# Altium project RFSoC-AMC.PrjPCB (part 3 of 22)

## Sheet RFMC_DAC.SchDoc: RFSoC AMC
size 420 x 297 mm; CompanyName: WUT; DrawnBy: T. Przywozki; Organization: WUT ISE; Address1: Warsaw University of Technology; Address2: Nowowiejska 15/19 00-665 Warsaw; Address3: Tomasz.Przywozki@pw.edu.pl; DocumentNumber: 43; Revision: 1; SheetNumber: 43; SheetTotal: 45; Project: RFSoC AMC; ModifiedBy: T. Przywozki; CreateDate: -; CheckedDate: -; DivGrp: ISE; Designer: T. Przywozki; ModifiedDate: -; ProjectName: ADC/DAC MEZZANINE
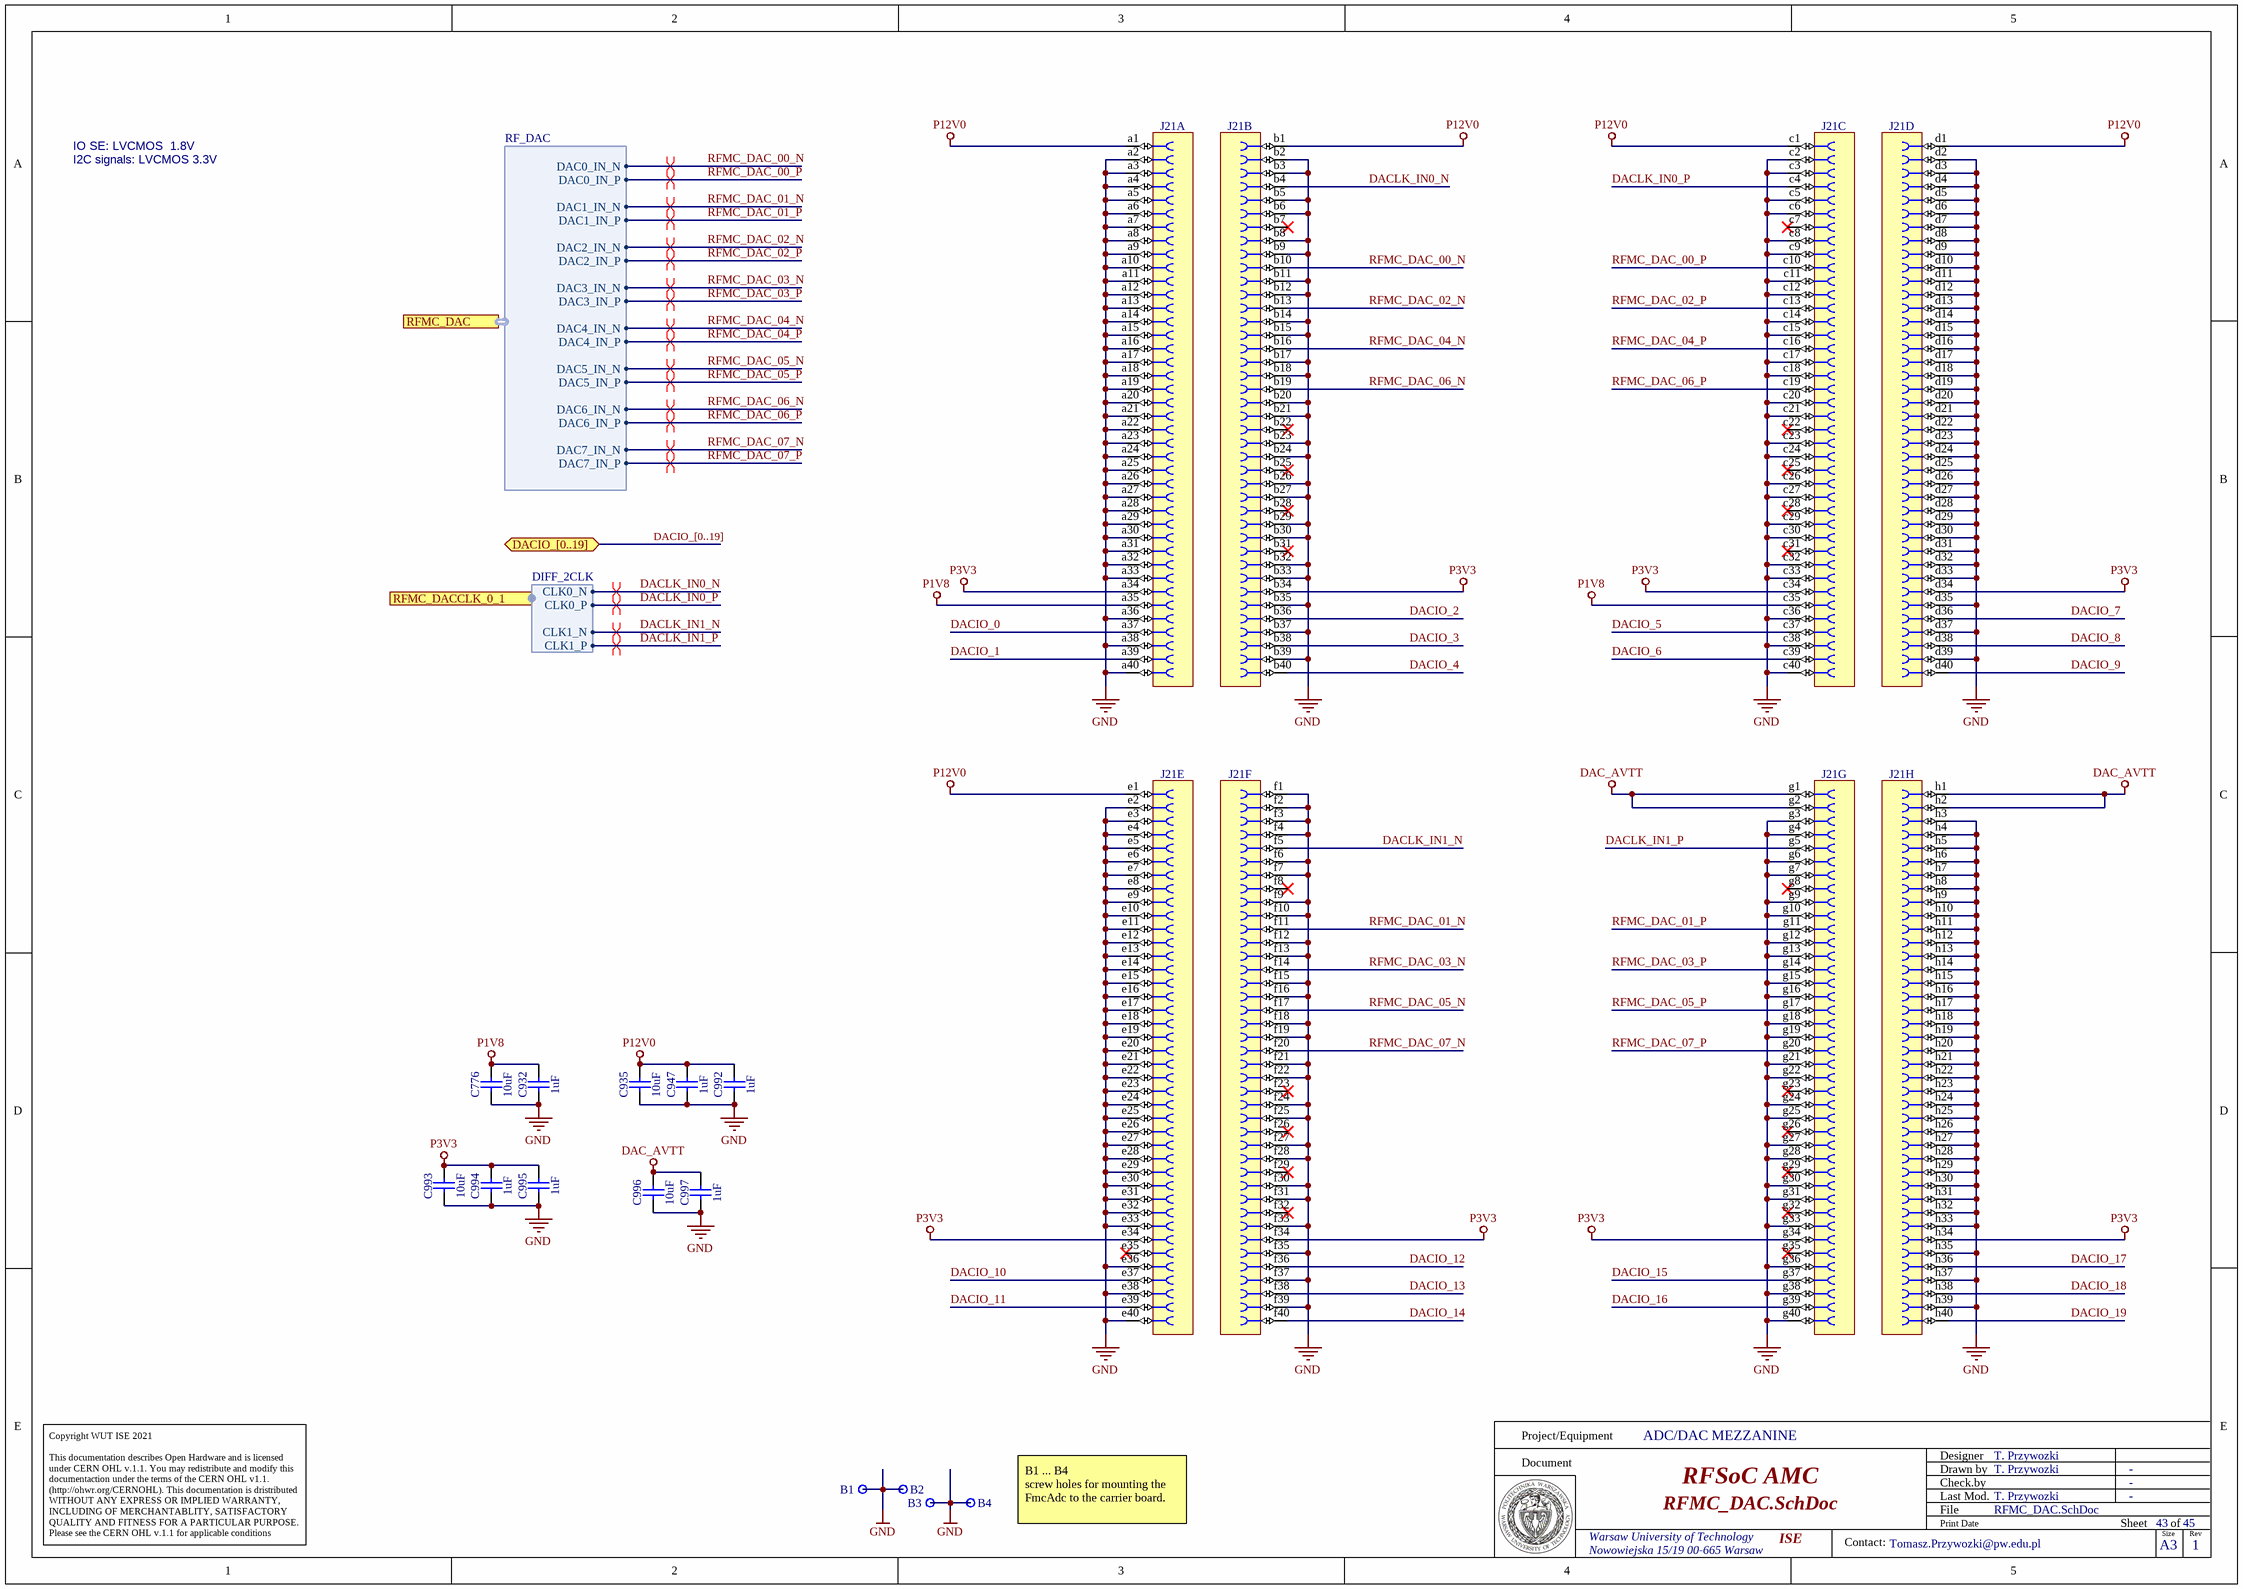
[diagram p4: RFMC_DAC.SchDoc]

### Parts
B1  Plated Hole  [MTG270_500]  (value not drawn)
B2  Plated Hole  [MTG270_500]  (value not drawn)
B3  Plated Hole  [MTG270_500]  (value not drawn)
B4  Plated Hole  [MTG270_500]  (value not drawn)
C776  10uF  [CAPC1608X80N]
C932  1uF  [CAPC1005X55N]
C935  10uF  [CAPC1608X80N]
C947  1uF  [CAPC1005X55N]
C992  1uF  [CAPC1005X55N]
C993  10uF  [CAPC1608X80N]
C994  1uF  [CAPC1005X55N]
C995  1uF  [CAPC1005X55N]
C996  10uF  [CAPC1608X80N]
C997  1uF  [CAPC1005X55N]
J21  (no value)  [SAMTEC_LPAF-40-03.0-S-08]  (parts A,B,C,D,E,F,G,H of 8)

### Ports
DACIO_[0..19] (bidir), RFMC_DAC (harness RF_DAC), RFMC_DACCLK_0_1 (harness DIFF_2CLK)

### Harnesses
RF_DAC: DAC0_IN_N, DAC0_IN_P, DAC1_IN_N, DAC1_IN_P, DAC2_IN_N, DAC2_IN_P, DAC3_IN_N, DAC3_IN_P, DAC4_IN_N, DAC4_IN_P, DAC5_IN_N, DAC5_IN_P, DAC6_IN_N, DAC6_IN_P, DAC7_IN_N, DAC7_IN_P
DIFF_2CLK: CLK0_P, CLK0_N, CLK1_P, CLK1_N

### Nets
DAC_AVTT: C996.2 C997.1 J21.g1 J21.g2 J21.h1 J21.h2
GND: B1.1 B2.1 B3.1 B4.1 C776.1 C932.2 C935.1 C947.2 C992.2 C993.1 C994.2 C995.2 C996.1 C997.2 J21.a2 J21.a3 J21.a4 J21.a5 J21.a6 J21.a7 J21.a8 J21.a9 J21.a10 J21.a11 J21.a12 J21.a13 J21.a14 J21.a15 J21.a16 J21.a17 J21.a18 J21.a19 J21.a20 J21.a21 J21.a22 J21.a23 J21.a24 J21.a25 J21.a26 J21.a27 J21.a28 J21.a29 J21.a30 J21.a31 J21.a32 J21.a33 J21.a36 J21.a38 J21.a40 J21.b2 J21.b3 J21.b5 J21.b6 J21.b8 J21.b9 J21.b11 J21.b12 J21.b14 J21.b15 J21.b17 J21.b18 J21.b20 J21.b21 J21.b23 J21.b24 J21.b26 J21.b27 J21.b29 J21.b30 J21.b32 J21.b33 J21.b35 J21.b37 J21.b39 J21.c2 J21.c3 J21.c5 J21.c6 J21.c8 J21.c9 J21.c11 J21.c12 J21.c14 J21.c15 J21.c17 J21.c18 J21.c20 J21.c21 J21.c23 J21.c24 J21.c26 J21.c27 J21.c29 J21.c30 J21.c32 J21.c33 J21.c36 J21.c38 J21.c40 J21.d2 J21.d3 J21.d4 J21.d5 J21.d6 J21.d7 J21.d8 J21.d9 J21.d10 J21.d11 J21.d12 J21.d13 J21.d14 J21.d15 J21.d16 J21.d17 J21.d18 J21.d19 J21.d20 J21.d21 J21.d22 J21.d23 J21.d24 J21.d25 J21.d26 J21.d27 J21.d28 J21.d29 J21.d30 J21.d31 J21.d32 J21.d33 J21.d35 J21.d37 J21.d39 J21.e2 J21.e3 J21.e4 J21.e5 J21.e6 J21.e7 J21.e8 J21.e9 J21.e10 J21.e11 J21.e12 J21.e13 J21.e14 J21.e15 J21.e16 J21.e17 J21.e18 J21.e19 J21.e20 J21.e21 J21.e22 J21.e23 J21.e24 J21.e25 J21.e26 J21.e27 J21.e28 J21.e29 J21.e30 J21.e31 J21.e32 J21.e33 J21.e36 J21.e38 J21.e40 J21.f1 J21.f2 J21.f3 J21.f4 J21.f6 J21.f7 J21.f9 J21.f10 J21.f12 J21.f13 J21.f15 J21.f16 J21.f18 J21.f19 J21.f21 J21.f22 J21.f24 J21.f25 J21.f27 J21.f28 J21.f30 J21.f31 J21.f33 J21.f35 J21.f37 J21.f39 J21.g3 J21.g4 J21.g6 J21.g7 J21.g9 J21.g10 J21.g12 J21.g13 J21.g15 J21.g16 J21.g18 J21.g19 J21.g21 J21.g22 J21.g24 J21.g25 J21.g27 J21.g28 J21.g30 J21.g31 J21.g33 J21.g36 J21.g38 J21.g40 J21.h3 J21.h4 J21.h5 J21.h6 J21.h7 J21.h8 J21.h9 J21.h10 J21.h11 J21.h12 J21.h13 J21.h14 J21.h15 J21.h16 J21.h17 J21.h18 J21.h19 J21.h20 J21.h21 J21.h22 J21.h23 J21.h24 J21.h25 J21.h26 J21.h27 J21.h28 J21.h29 J21.h30 J21.h31 J21.h32 J21.h33 J21.h35 J21.h37 J21.h39
P1V8: C776.2 C932.1 J21.a35 J21.c35
P3V3: C993.2 C994.1 C995.1 J21.a34 J21.b34 J21.c34 J21.d34 J21.e34 J21.f34 J21.g34 J21.h34
P12V0: C935.2 C947.1 C992.1 J21.a1 J21.b1 J21.c1 J21.d1 J21.e1
DACIO_0: J21.a37
DACIO_1: J21.a39
DACIO_2: J21.b36
DACIO_3: J21.b38
DACIO_4: J21.b40
DACIO_5: J21.c37
DACIO_6: J21.c39
DACIO_7: J21.d36
DACIO_8: J21.d38
DACIO_9: J21.d40
DACIO_10: J21.e37
DACIO_11: J21.e39
DACIO_12: J21.f36
DACIO_13: J21.f38
DACIO_14: J21.f40
DACIO_15: J21.g37
DACIO_16: J21.g39
DACIO_17: J21.h36
DACIO_18: J21.h38
DACIO_19: J21.h40
DACLK_IN0_N: J21.b4 ; port RFMC_DACCLK_0_1.CLK0_N
DACLK_IN0_P: J21.c4 ; port RFMC_DACCLK_0_1.CLK0_P
DACLK_IN1_N: J21.f5 ; port RFMC_DACCLK_0_1.CLK1_N
DACLK_IN1_P: J21.g5 ; port RFMC_DACCLK_0_1.CLK1_P
RFMC_DAC_00_N: J21.b10 ; port RFMC_DAC.DAC0_IN_N  [project net DAC0_OUT_N]
RFMC_DAC_00_P: J21.c10 ; port RFMC_DAC.DAC0_IN_P  [project net DAC0_OUT_P]
RFMC_DAC_01_N: J21.f11 ; port RFMC_DAC.DAC1_IN_N  [project net DAC1_OUT_N]
RFMC_DAC_01_P: J21.g11 ; port RFMC_DAC.DAC1_IN_P  [project net DAC1_OUT_P]
RFMC_DAC_02_N: J21.b13 ; port RFMC_DAC.DAC2_IN_N  [project net DAC2_OUT_N]
RFMC_DAC_02_P: J21.c13 ; port RFMC_DAC.DAC2_IN_P  [project net DAC2_OUT_P]
RFMC_DAC_03_N: J21.f14 ; port RFMC_DAC.DAC3_IN_N  [project net DAC3_OUT_N]
RFMC_DAC_03_P: J21.g14 ; port RFMC_DAC.DAC3_IN_P  [project net DAC3_OUT_P]
RFMC_DAC_04_N: J21.b16 ; port RFMC_DAC.DAC4_IN_N  [project net DAC4_OUT_N]
RFMC_DAC_04_P: J21.c16 ; port RFMC_DAC.DAC4_IN_P  [project net DAC4_OUT_P]
RFMC_DAC_05_N: J21.f17 ; port RFMC_DAC.DAC5_IN_N  [project net DAC5_OUT_N]
RFMC_DAC_05_P: J21.g17 ; port RFMC_DAC.DAC5_IN_P  [project net DAC5_OUT_P]
RFMC_DAC_06_N: J21.b19 ; port RFMC_DAC.DAC6_IN_N  [project net DAC6_OUT_N]
RFMC_DAC_06_P: J21.c19 ; port RFMC_DAC.DAC6_IN_P  [project net DAC6_OUT_P]
RFMC_DAC_07_N: J21.f20 ; port RFMC_DAC.DAC7_IN_N  [project net DAC7_OUT_N]
RFMC_DAC_07_P: J21.g20 ; port RFMC_DAC.DAC7_IN_P  [project net DAC7_OUT_P]

Not connected (* = marked no-connect by the designer): J21 b7* b22* b25* b28* b31* c7* c22* c25* c28* c31* e35* f8* f23* f26* f29* f32* g8* g23* g26* g29* g32* g35*

### Buses and harness runs
bus DACIO_[0..19] = port DACIO_[0..19]

### Layout directives
differential pair: DAC0_OUT_N, DAC0_OUT_P, DAC1_OUT_N, DAC1_OUT_P, DAC2_OUT_N, DAC2_OUT_P, DAC3_OUT_N, DAC3_OUT_P, DAC4_OUT_N, DAC4_OUT_P, DAC5_OUT_N, DAC5_OUT_P, DAC6_OUT_N, DAC6_OUT_P, DAC7_OUT_N, DAC7_OUT_P, DACLK_IN0_N, DACLK_IN0_P, DACLK_IN1_N, DACLK_IN1_P

### Notes on the sheet
- I2C signals: LVCMOS 3.3V
- IO SE: LVCMOS  1.8V
- (near B4) B1 ... B4
  screw holes for mounting the FmcAdc to the carrier board.
- Project/Equipment
- Document
- Designer
- Drawn by
- Check.by
- Copyright WUT ISE 2021
  This documentation describes Open Hardware and is licensed under CERN OHL v.1.1. You may redistribute and modify this documentaction under the terms of the CERN OHL v1.1.
  (http://ohwr.org/CERNOHL). This documentation is dristributed WITHOUT ANY EXPRESS OR IMPLIED WARRANTY, INCLUDING OF MERCHANTABLITY, SATISFACTORY QUALITY AND FITNESS FOR A PARTICULAR PURPOSE. Please see the CERN OHL v.1.1 for applicable conditions
- File
- Last Mod.
- Print Date
- Sheet
- Size
- A3
- of
- Rev
- Contact:

### Library data of the parts
B1-B4 = PLATED_HOLE2.7_PAD5.0: Single Terminal Socket; Part Description: Plated Through Hole: Hole Dia.=2.7mm Pad Dia.=5.0mm; Mounted: No; Part Number: PLATED_HOLE2.7_PAD5.0; Component Kind: Standard (No BOM); Component Type: Standard (No BOM); Pin Count: 1; Family: Plated Hole; Socket: No; SMD: No; Sense: No; Status: None; ComponentHeight: 0mm; HelpURL: Undefined; Author: CERN DEM JMW; CreateDate: 27.09.2011; LatestRevisionDate: 27.09.2011; PackageDescription: Plated Through Hole: Hole Dia.=2.7mm Pad Dia.=5.0mm
C776 C935 C993 C996 = CC0603_10UF_10V_10%_X5R: Non-polarised capacitor; Part Description: SMD Multilayer Chip Ceramic Capacitor; Manufacturer: GENERIC; Manufacturer1 Part Number: GRM188R61A106KE69D; Voltage: 10V; TC: X5R; Tolerance: ±10%; Part Number: CC0603_10UF_10V_10%_X5R; Component Kind: Standard; Component Type: Standard; Pin Count: 2; Value: 10uF; Status: None; Manufacturer Part Number: CC0603_10UF_10V_10%_X5R; Case: 0603; Mounted: Yes; Socket: No; SMD: Yes; Sense: No; Manufacturer1 Example: MURATA; Manufacturer1 ComponentHeight: 0.8mm; HelpURL: \\cern.ch\dfs\Applications\Altium\Datasheets\CC0603_MURATA_GRM188R61A106KE69D.pdf; Author: CERN DEM JLC; CreateDate: 31.01.2017; LatestRevisionDate: 31.01.2017
C932 C947 C992 C994 C995 C997 = CC0402_1UF_16V_10%_X5R: Non-polarised capacitor; Part Description: SMD Multilayer Chip Ceramic Capacitor; Manufacturer: GENERIC; Manufacturer1 Part Number: C1005X5R1C105KT; Voltage: 16V; TC: X5R; Tolerance: ±10%; Part Number: CC0402_1UF_16V_10%_X5R; Component Kind: Standard; Component Type: Standard; Pin Count: 2; Value: 1uF; Status: Preferred; Manufacturer Part Number: CC0402_1UF_16V_10%_X5R; Case: 0402; Mounted: Yes; Socket: No; SMD: Yes; Sense: No; Manufacturer1 Example: TDK; Manufacturer1 ComponentHeight: 0.55mm; HelpURL: \\cern.ch\dfs\Applications\Altium\Datasheets\CC0402_X5R_TDK_C.pdf; Author: CERN DEM JLC; CreateDate: 25.10.2012; LatestRevisionDate: 25.10.2012
J21 = SAMTEC_LPAF-40-03.0-S-08-2-K: Connector 320 Female contacts in 8 row abcdef; Part Description: 320 Contacts (8x40), Pitch 1.27mm, Straight High Speed Low-Profile Open-Pin-Field Socket; Manufacturer: SAMTEC; PressFit: No; Sense Comment: Solder Paste Deposition Sensitive – Check Manufacturer Recommendations for Stencil Design; Part Number: SAMTEC_LPAF-40-03.0-S-08-2-K; Component Kind: Standard; Component Type: Standard; Pin Count: 320; Mounted: Yes; Socket: No; SMD: Yes; Sense: Yes; Status: None; Manufacturer Part Number: LPAF-40-03.0-S-08-2-K; ComponentHeight: 2.79mm; HelpURL: \\cern.ch\dfs\Applications\Altium\Datasheets\SAMTEC_LPAF-40-03.0-S-08-2-K.pdf; Author: CERN DEM BC; CreateDate: 02.12.2020; LatestRevisionDate: 02.12.2020

## Sheet ADC_PLL.SchDoc: RFSoC AMC
size 420 x 297 mm; CompanyName: WUT; DrawnBy: T. Przywozki; Organization: WUT ISE; Address1: Warsaw University of Technology; Address2: Nowowiejska 15/19 00-665 Warsaw; Address3: Tomasz.Przywozki@pw.edu.pl; DocumentNumber: 19; Revision: 1; SheetNumber: 19; SheetTotal: 45; Project: RFSoC AMC; ModifiedBy: T. Przywozki; CreateDate: -; CheckedDate: -; DivGrp: ISE; Designer: T. Przywozki; ModifiedDate: -; ProjectName: ADC/DAC MEZZANINE
Used 2 times, as channels U_ADC_PLL, U_ADC_PLL. Parts and nets are listed once, with the designators drawn on the sheet.
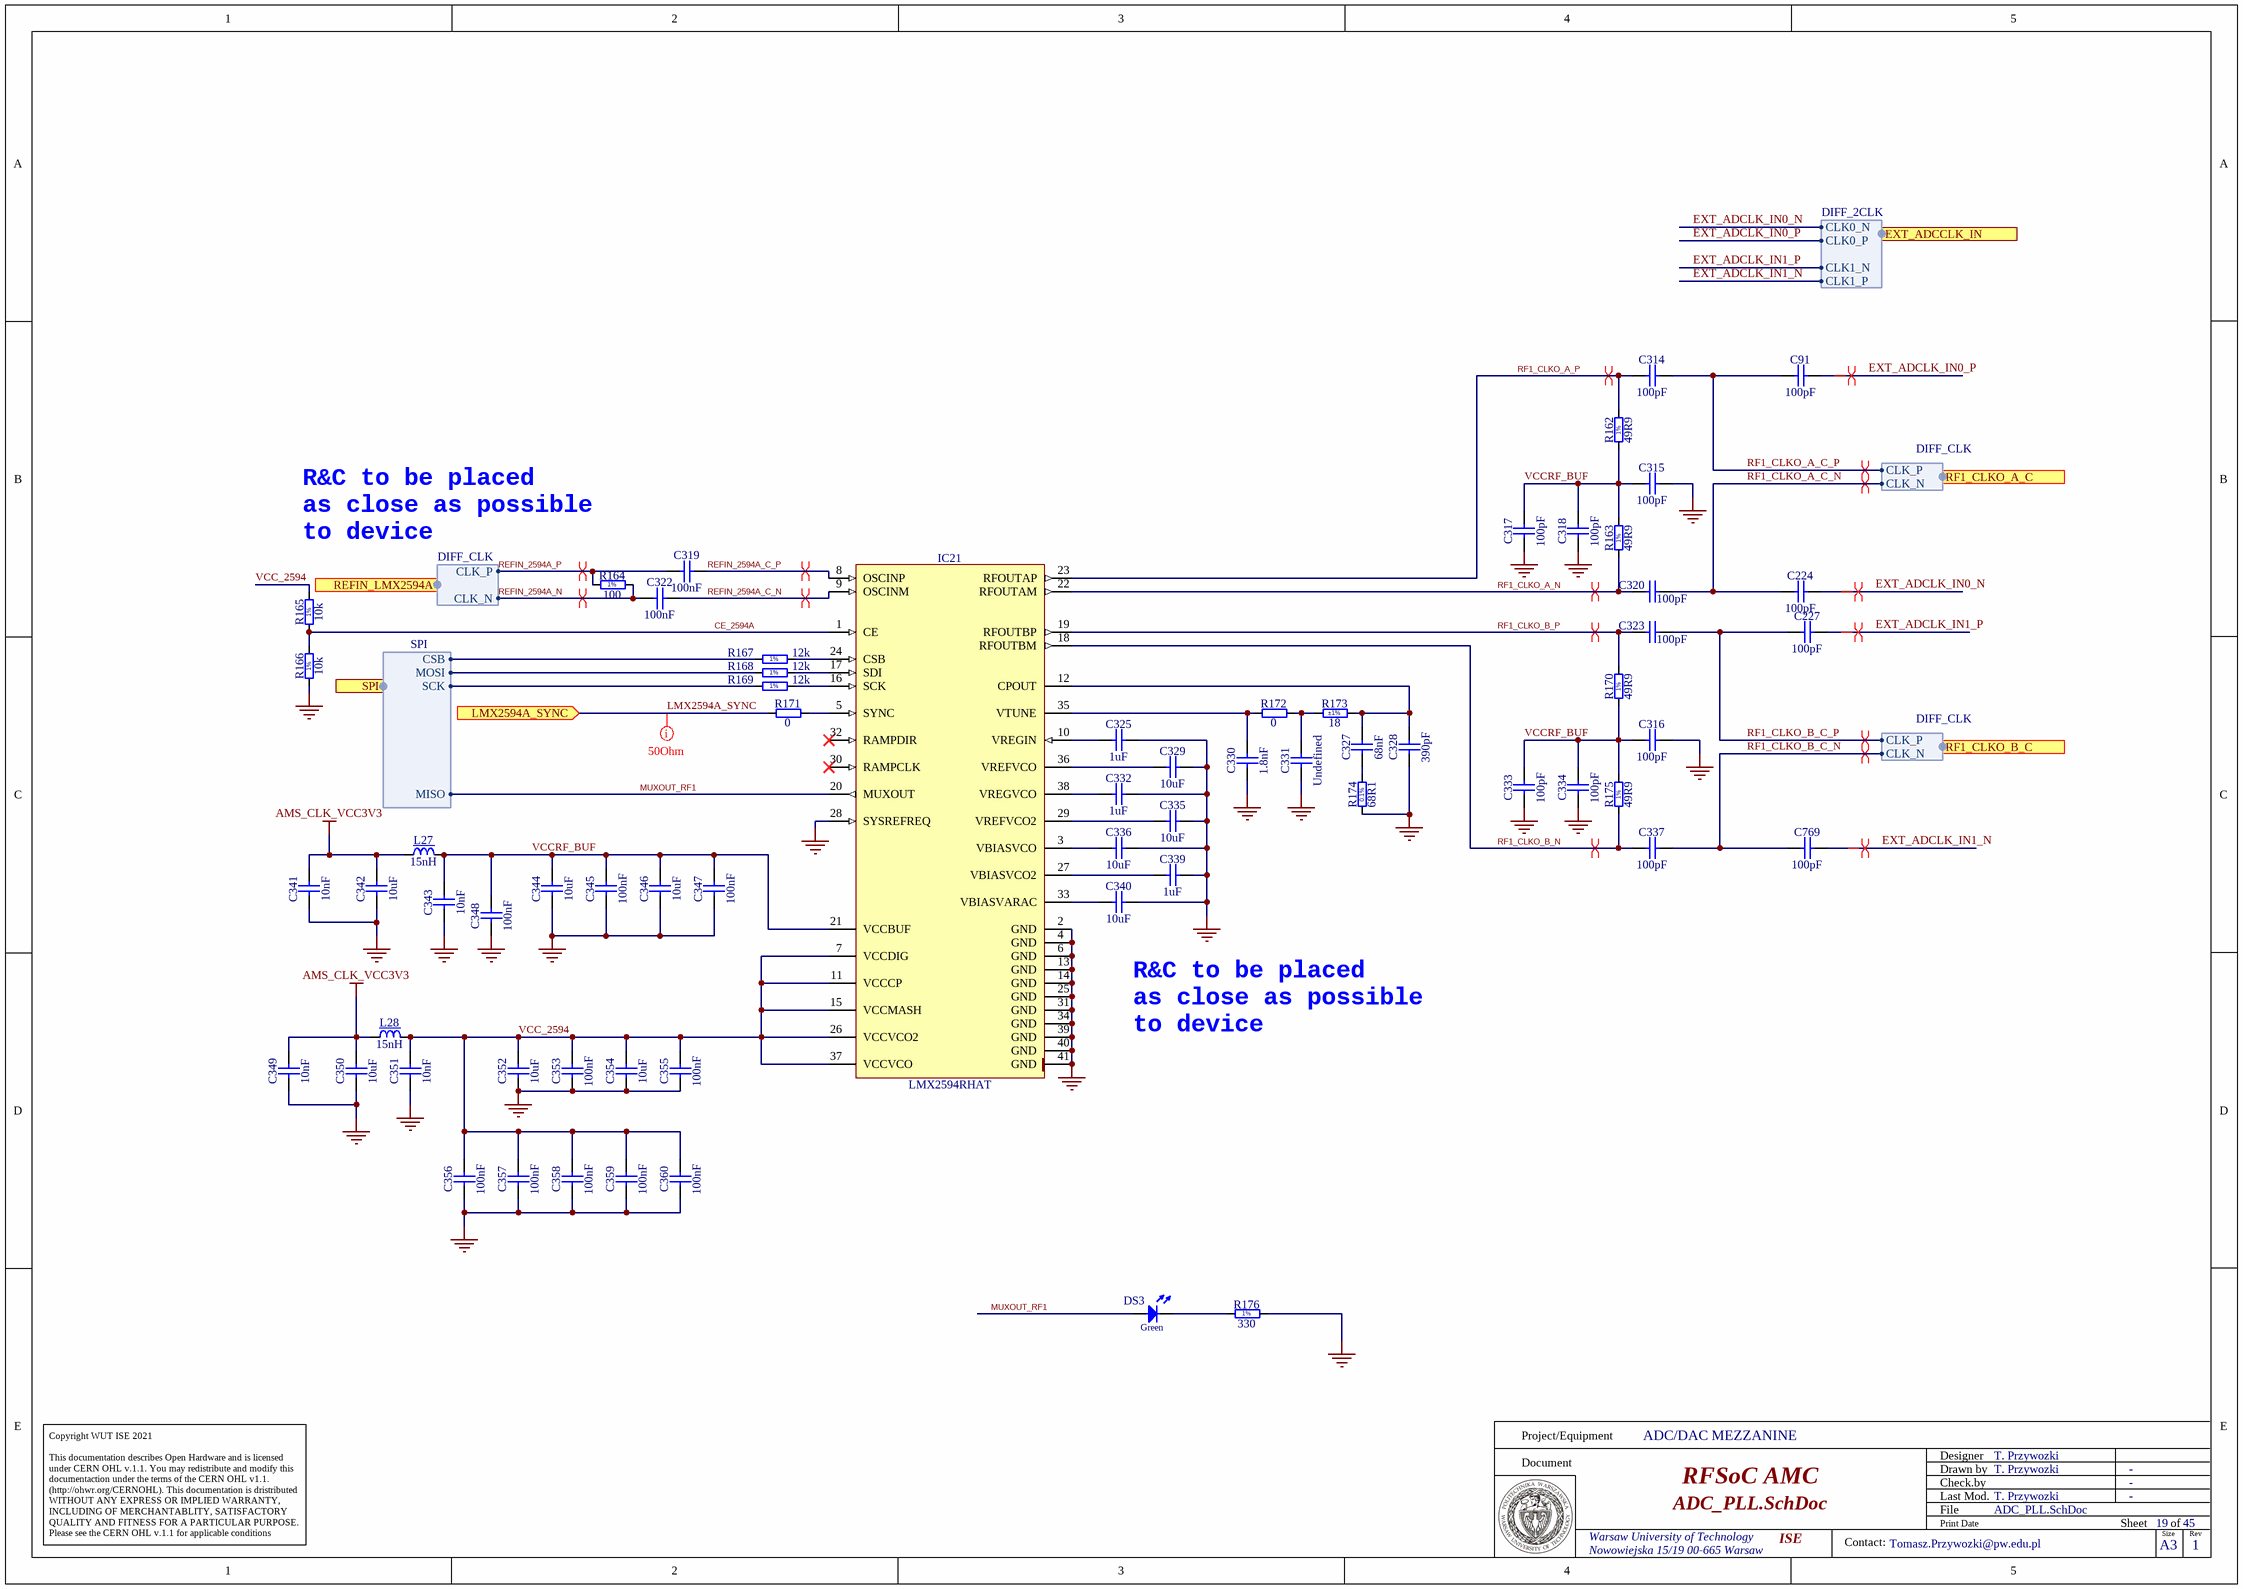
[diagram p5: ADC_PLL.SchDoc]

### Parts
C91  100pF  [CAPC1005X55N]
C224  100pF  [CAPC1005X55N]
C227  100pF  [CAPC1005X55N]
C314  100pF  [CAPC1005X55N]
C315  100pF  [CAPC1005X55N]
C316  100pF  [CAPC1005X55N]
C317  100pF  [CAPC1005X55N]
C318  100pF  [CAPC1005X55N]
C319  100nF  [CAPC1005X55N]
C320  100pF  [CAPC1005X55N]
C322  100nF  [CAPC1005X55N]
C323  100pF  [CAPC1005X55N]
C325  1uF  [CAPC1005X55N]
C327  68nF  [CAPC1005X55N]
C328  390pF  [CAPC1608X87N]
C329  10uF  [CAPC1608X80N]
C330  1.8nF  [CAPC1608X87N]
C331  Undefined  [CAPC1005X55N]
C332  1uF  [CAPC1005X55N]
C333  100pF  [CAPC1005X55N]
C334  100pF  [CAPC1005X55N]
C335  10uF  [CAPC1608X80N]
C336  10uF  [CAPC1608X80N]
C337  100pF  [CAPC1005X55N]
C339  1uF  [CAPC1005X55N]
C340  10uF  [CAPC1608X80N]
C341  10nF  [CAPC1005X55N]
C342  10uF  [CAPC1608X80N]
C343  10nF  [CAPC1005X55N]
C344  10uF  [CAPC1608X80N]
C345  100nF  [CAPC1005X55N]
C346  10uF  [CAPC1608X80N]
C347  100nF  [CAPC1005X55N]
C348  100nF  [CAPC1005X55N]
C349  10nF  [CAPC1005X55N]
C350  10uF  [CAPC1608X80N]
C351  10nF  [CAPC1005X55N]
C352  10uF  [CAPC1608X80N]
C353  100nF  [CAPC1005X55N]
C354  10uF  [CAPC1608X80N]
C355  100nF  [CAPC1005X55N]
C356  100nF  [CAPC1005X55N]
C357  100nF  [CAPC1005X55N]
C358  100nF  [CAPC1005X55N]
C359  100nF  [CAPC1005X55N]
C360  100nF  [CAPC1005X55N]
C769  100pF  [CAPC1005X55N]
DS3  Green  [LED_OSRAM_LGL29K]
IC21  LMX2594RHAT  [QFN50P600X600X100-41N-S460]
L27  15nH  [IND_COILCRAFT_0402DC]
L28  15nH  [IND_COILCRAFT_0402DC]
R162  49R9  [RESC1005X40N]
R163  49R9  [RESC1005X40N]
R164  100  [RESC1005X40N]
R165  10k  [RESC1005X40N]
R166  10k  [RESC1005X40N]
R167  12k  [RESC1005X40N]
R168  12k  [RESC1005X40N]
R169  12k  [RESC1005X40N]
R170  49R9  [RESC1005X40N]
R171  0  [RESC1005X40N]
R172  0  [RESC1005X40N]
R173  18  Tolerance: ±1%  [RESC1005X40N]
R174  68R1  [RESC1608X55N]
R175  49R9  [RESC1005X40N]
R176  330  [RESC1005X40N]

### Ports
EXT_ADCCLK_IN (harness DIFF_2CLK), LMX2594A_SYNC (in), REFIN_LMX2594A (harness DIFF_CLK), RF1_CLKO_A_C (harness DIFF_CLK), RF1_CLKO_B_C (in, harness DIFF_CLK), SPI (harness SPI)

### Harnesses
DIFF_CLK: CLK_P, CLK_N
SPI: MOSI, MISO, CSB, SCK
DIFF_2CLK: CLK0_P, CLK0_N, CLK1_P, CLK1_N

### Nets
AMS_CLK_VCC3V3: C341.2 C342.2 C349.2 C350.2 L27.1 L28.1
GND: C315.2 C316.2 C317.1 C318.1 C325.1 C328.1 C329.1 C330.1 C331.1 C332.1 C333.1 C334.1 C335.1 C336.1 C339.1 C340.1 C341.1 C342.1 C343.1 C344.1 C345.1 C346.1 C347.1 C348.1 C349.1 C350.1 C351.1 C352.1 C353.1 C354.1 C355.1 C356.1 C357.1 C358.1 C359.1 C360.1 IC21.2(GND) IC21.4(GND) IC21.6(GND) IC21.13(GND) IC21.14(GND) IC21.25(GND) IC21.28(SYSREFREQ) IC21.31(GND) IC21.34(GND) IC21.39(GND) IC21.40(GND) IC21.41(GND) R166.1 R174.1 R176.2
CE_2594A: IC21.1(CE) R165.1 R166.2
EXT_ADCLK_IN0_N: C224.2 ; port EXT_ADCCLK_IN.CLK0_N
EXT_ADCLK_IN0_P: C91.2 ; port EXT_ADCCLK_IN.CLK0_P
EXT_ADCLK_IN1_N: C769.2 ; port EXT_ADCCLK_IN.CLK1_P
EXT_ADCLK_IN1_P: C227.2 ; port EXT_ADCCLK_IN.CLK1_N
LMX2594A_SYNC: R171.1 ; port LMX2594A_SYNC
MUXOUT_RF1: DS3.2(A) IC21.20(MUXOUT) ; port SPI.MISO
REFIN_2594A_C_N: C322.2 IC21.9(OSCINM)
REFIN_2594A_C_P: C319.2 IC21.8(OSCINP)
REFIN_2594A_N: C322.1 R164.2 ; port REFIN_LMX2594A.CLK_N
REFIN_2594A_P: C319.1 R164.1 ; port REFIN_LMX2594A.CLK_P
RF1_CLKO_A_C_N: C224.1 C320.2 ; port RF1_CLKO_A_C.CLK_N
RF1_CLKO_A_C_P: C91.1 C314.2 ; port RF1_CLKO_A_C.CLK_P
RF1_CLKO_A_N: C320.1 IC21.22(RFOUTAM) R163.1
RF1_CLKO_A_P: C314.1 IC21.23(RFOUTAP) R162.2
RF1_CLKO_B_C_N: C337.2 C769.1 ; port RF1_CLKO_B_C.CLK_N
RF1_CLKO_B_C_P: C227.1 C323.2 ; port RF1_CLKO_B_C.CLK_P
RF1_CLKO_B_N: C337.1 IC21.18(RFOUTBM) R175.1
RF1_CLKO_B_P: C323.1 IC21.19(RFOUTBP) R170.2
VCC_2594: C351.2 C352.2 C353.2 C354.2 C355.2 C356.2 C357.2 C358.2 C359.2 C360.2 IC21.7(VCCDIG) IC21.11(VCCCP) IC21.15(VCCMASH) IC21.26(VCCVCO2) IC21.37(VCCVCO) L28.2 R165.2
VCCRF_BUF: C315.1 C316.1 C317.2 C318.2 C333.2 C334.2 C343.2 C344.2 C345.2 C346.2 C347.2 C348.2 IC21.21(VCCBUF) L27.2 R162.1 R163.2 R170.1 R175.2
NetC325_2: C325.2 IC21.10(VREGIN)
NetC327_1: C327.1 R174.2
NetC327_2: C327.2 C328.2 IC21.12(CPOUT) R173.2
NetC329_2: C329.2 IC21.36(VREFVCO)
NetC330_2: C330.2 IC21.35(VTUNE) R172.1
NetC331_2: C331.2 R172.2 R173.1
NetC332_2: C332.2 IC21.38(VREGVCO)
NetC335_2: C335.2 IC21.29(VREFVCO2)
NetC336_2: C336.2 IC21.3(VBIASVCO)
NetC339_2: C339.2 IC21.27(VBIASVCO2)
NetC340_2: C340.2 IC21.33(VBIASVARAC)
NetDS3_1: DS3.1(C) R176.1
NetIC21_5: IC21.5(SYNC) R171.2
NetIC21_16: IC21.16(SCK) R169.1
NetIC21_17: IC21.17(SDI) R168.1
NetIC21_24: IC21.24(CSB) R167.1
NetR167_2: R167.2 ; port SPI.CSB
NetR168_2: R168.2 ; port SPI.MOSI
NetR169_2: R169.2 ; port SPI.SCK

Not connected (* = marked no-connect by the designer): IC21 30(RAMPCLK)* 32(RAMPDIR)*

### Channels
U_ADC_PLL: designators end in _U_ADC_PLL#1; ports LMX2594A_SYNC=LMX2594A
U_ADC_PLL: designators end in _U_ADC_PLL#2; ports LMX2594A_SYNC=LMX2594A_SYNC

### Layout directives
differential pair; differential pair class Diff_100Ohm: ADCLK_IN0_N, ADCLK_IN0_P, ADCLK_IN1_N, ADCLK_IN1_P, REFIN_2594A_C_N_U_ADC_PLL, REFIN_2594A_C_P_U_ADC_PLL, REFIN_2594A_N, REFIN_2594A_P, RF1_CLKO_A_C_N, RF1_CLKO_A_C_P, RF1_CLKO_A_N_U_ADC_PLL, RF1_CLKO_A_P_U_ADC_PLL, RF1_CLKO_B_C_N, RF1_CLKO_B_C_P, RF1_CLKO_B_N_U_ADC_PLL, RF1_CLKO_B_P_U_ADC_PLL
mark named 50Ohm: LMX2594A

### Notes on the sheet
- (near C319) R&C to be placed
  as close as possible
  to device
- R&C to be placed
  as close as possible
  to device
- Project/Equipment
- Document
- Designer
- Drawn by
- Check.by
- Copyright WUT ISE 2021
  This documentation describes Open Hardware and is licensed under CERN OHL v.1.1. You may redistribute and modify this documentaction under the terms of the CERN OHL v1.1.
  (http://ohwr.org/CERNOHL). This documentation is dristributed WITHOUT ANY EXPRESS OR IMPLIED WARRANTY, INCLUDING OF MERCHANTABLITY, SATISFACTORY QUALITY AND FITNESS FOR A PARTICULAR PURPOSE. Please see the CERN OHL v.1.1 for applicable conditions
- File
- Last Mod.
- Print Date
- Sheet
- Size
- A3
- of
- Rev
- Contact:
- (in symbol R0402_10K_1%_0.0625W_100PPM) 1%
- (in symbol R0402_12K_1%_0.0625W_100PPM) 1%
- (in symbol R0402_49R9_1%_0.0625W_100PPM) 1%
- (in symbol R0402_100R_1%_0.1W_100PPM) 1%
- (in symbol R0402_330R_1%_0.0625W_100PPM) 1%
- (in symbol R0603_68R1_0.1%_0.063W_10PPM) 0.1%

### Library data of the parts
C91 C224 C227 C314-C318 C320 C323 C333 C334 C337 C769 = CC0402_100PF_25V_5%_C0G_KEMET_HiQ-CBR: Non-polarised capacitor; Part Description: High Q and low ESR, SMD Multilayer Chip Ceramic Capacitor, HiQ-CBR Series; Manufacturer: KEMET; Manufacturer Part Number: CBR04C101J3GAC; Voltage: 25V; TC: C0G/NP0; Tolerance: ±5%; Part Number: CC0402_100PF_25V_5%_C0G_KEMET_HiQ-CBR; Component Kind: Standard; Component Type: Standard; Pin Count: 2; Value: 100pF; Status: Not Recommended; Case: 0402; Mounted: Yes; Socket: No; SMD: Yes; Sense: No; ComponentHeight: 0.55mm; HelpURL: \\cern.ch\dfs\Applications\Altium\Datasheets\CC0402_C0G_KEMET_HiQ-CBR.pdf; Author: CERN DEM MR; CreateDate: 17.11.2017; LatestRevisionDate: 21.11.2017
C319 C322 C345 C347 C348 C353 C355-C360 = CC0402_100NF_25V_10%_X7R_YUDEN_TMK105B7104KVHF: Non-polarised capacitor; Part Description: SMD Multilayer Chip Ceramic Capacitor (High Dielectric Type) for Automotive / Industrial Applications; Manufacturer: TAIYO YUDEN; Voltage: 25V; TC: X7R; Tolerance: ±10%; Part Number: CC0402_100NF_25V_10%_X7R_YUDEN_TMK105B7104KVHF; Component Kind: Standard; Component Type: Standard; Pin Count: 2; Value: 100nF; Status: Not Recommended; Manufacturer Part Number: TMK105B7104KVHF; Case: 0402; Mounted: Yes; Socket: No; SMD: Yes; Sense: No; ComponentHeight: 0.55mm; HelpURL: \\cern.ch\dfs\Applications\Altium\Datasheets\CC0402_TAIYO-YUDEN_TMK105B7104KVHF.pdf; Author: CERN DEM JLC; CreateDate: 10.05.2017; LatestRevisionDate: 10.05.2017
C325 C332 C339 = CC0402_1UF_16V_10%_X5R: as C932 on sheet RFMC_DAC; Part Number: CC0402_1UF_16V_10%_X5R; Component Kind: Standard; Component Type: Standard; Pin Count: 2; Value: 1uF; Status: Preferred; Manufacturer Part Number: CC0402_1UF_16V_10%_X5R; Case: 0402; Mounted: Yes; Socket: No; SMD: Yes; Sense: No; Manufacturer1 Example: TDK; Manufacturer1 ComponentHeight: 0.55mm; HelpURL: \\cern.ch\dfs\Applications\Altium\Datasheets\CC0402_X5R_TDK_C.pdf; Author: CERN DEM JLC; CreateDate: 25.10.2012; LatestRevisionDate: 25.10.2012
C327 = CC0402_68NF_16V_10%_X7R: Non-polarised capacitor; Part Description: SMD Multilayer Chip Ceramic Capacitor; Manufacturer: GENERIC; Manufacturer1 Part Number: 223878715647; Voltage: 16V; TC: X7R; Tolerance: ±10%; Part Number: CC0402_68NF_16V_10%_X7R; Component Kind: Standard; Component Type: Standard; Pin Count: 2; Value: 68nF; Status: Not Recommended; Manufacturer Part Number: CC0402_68NF_16V_10%_X7R; Case: 0402; Mounted: Yes; Socket: No; SMD: Yes; Sense: No; Manufacturer1 Example: PHYCOMP; Manufacturer1 ComponentHeight: 0.55mm; HelpURL: \\cern.ch\dfs\Applications\Altium\Datasheets\CC0402_X7R_PHYCOMP.pdf; Author: CERN DEM JLC; CreateDate: 03.12.2007; LatestRevisionDate: 03.12.2007
C328 = CC0603_390PF_50V_5%_NP0: Non-polarised capacitor; Part Description: SMD Multilayer Chip Ceramic Capacitor; Manufacturer: GENERIC; Manufacturer1 Part Number: 223886715391; Voltage: 50V; TC: NP0; Tolerance: ±5%; Part Number: CC0603_390PF_50V_5%_NP0; Component Kind: Standard; Component Type: Standard; Pin Count: 2; Value: 390pF; Status: Preferred; Manufacturer Part Number: CC0603_390PF_50V_5%_NP0; Case: 0603; Mounted: Yes; Socket: No; SMD: Yes; Sense: No; Manufacturer1 Example: PHYCOMP; Manufacturer1 ComponentHeight: 0.87mm; HelpURL: \\cern.ch\dfs\Applications\Altium\Datasheets\CC0603_NP0_PHYCOMP.pdf; Author: CERN DEM JLC; CreateDate: 03.12.2007; LatestRevisionDate: 03.12.2007
C329 C335 C336 C340 C342 C344 C346 C350 C352 C354 = CC0603_10UF_10V_10%_X5R: as C776 on sheet RFMC_DAC; Part Number: CC0603_10UF_10V_10%_X5R; Component Kind: Standard; Component Type: Standard; Pin Count: 2; Value: 10uF; Status: None; Manufacturer Part Number: CC0603_10UF_10V_10%_X5R; Case: 0603; Mounted: Yes; Socket: No; SMD: Yes; Sense: No; Manufacturer1 Example: MURATA; Manufacturer1 ComponentHeight: 0.8mm; HelpURL: \\cern.ch\dfs\Applications\Altium\Datasheets\CC0603_MURATA_GRM188R61A106KE69D.pdf; Author: CERN DEM JLC; CreateDate: 31.01.2017; LatestRevisionDate: 31.01.2017
C330 = CC0603_1.8NF_50V_5%_X7R: Non-polarised capacitor; Part Description: SMD Multilayer Chip Ceramic Capacitor; Manufacturer: GENERIC; Manufacturer1 Part Number: C0603C182J5RACTU; Voltage: 50V; TC: X7R; Tolerance: ±5%; Part Number: CC0603_1.8NF_50V_5%_X7R; Component Kind: Standard; Component Type: Standard; Pin Count: 2; Value: 1.8nF; Status: Preferred; Manufacturer Part Number: CC0603_1.8NF_50V_5%_X7R; Case: 0603; Mounted: Yes; Socket: No; SMD: Yes; Sense: No; Manufacturer1 Example: KEMET; Manufacturer1 ComponentHeight: 0.87mm; HelpURL: \\cern.ch\dfs\Applications\Altium\Datasheets\CC0603_X7R_KEMET.pdf; Author: CERN DEM JLC; CreateDate: 31.05.2018; LatestRevisionDate: 31.05.2018
C331 = CC0402_NO-VALUE: Non-polarised capacitor; Part Description: Reserved Footprint For 0402(1005) Chip Ceramic Capacitor; Mounted: No; Part Number: CC0402_NO-VALUE; Component Kind: Standard; Component Type: Standard; Pin Count: 2; Value: Undefined; Status: None; Manufacturer: Undefined; Manufacturer Part Number: CC0402_NO-VALUE; Case: 0402; Socket: No; SMD: Yes; Sense: No; Manufacturer1 ComponentHeight: 0.55mm; HelpURL: Undefined; Author: CERN DEM JLC; CreateDate: 14.01.2014; LatestRevisionDate: 14.01.2014
C341 C343 C349 C351 = CC0402_10NF_16V_10%_X7R: Non-polarised capacitor; Part Description: SMD Multilayer Chip Ceramic Capacitor; Manufacturer: GENERIC; Manufacturer1 Part Number: 223878715636; Voltage: 16V; TC: X7R; Tolerance: ±10%; Part Number: CC0402_10NF_16V_10%_X7R; Component Kind: Standard; Component Type: Standard; Pin Count: 2; Value: 10nF; Status: Not Recommended; Manufacturer Part Number: CC0402_10NF_16V_10%_X7R; Case: 0402; Mounted: Yes; Socket: No; SMD: Yes; Sense: No; Manufacturer1 Example: PHYCOMP; Manufacturer1 ComponentHeight: 0.55mm; HelpURL: \\cern.ch\dfs\Applications\Altium\Datasheets\CC0402_X7R_PHYCOMP.pdf; Author: CERN DEM JLC; CreateDate: 03.12.2007; LatestRevisionDate: 03.12.2007
DS3 = LED_OSRAM_LG L29K-G2J1-24-Z: LED Green 1C 2A; Part Description: Surface Mount Green LED (0603 Case); Manufacturer: OSRAM; PressFit: No; Bonding: No; Status Comment: Sourcing Difficulty; Part Number: LED_OSRAM_LG L29K-G2J1-24-Z; Component Kind: Standard; Component Type: Standard; Color: Green; PackageDescription: Green Chip LED, 2-Leads, Body 1.7x0.8mm, IPC Medium Density; Status: Not Recommended; Manufacturer Part Number: LG L29K-G2J1-24-Z; Pin Count: 2; Case: 0603; Mounted: Yes; Socket: No; SMD: Yes; Sense: No; ComponentHeight: 0.67mm; HelpURL: \\cern.ch\dfs\Applications\Altium\Datasheets\LED_OSRAM_LGL29K.pdf; Author: CERN DEM JLC; CreateDate: 24.04.2012; LatestRevisionDate: 24.04.2012
IC21 = LMX2594RHAT: 15GHz Wideband PLLatinum RF Synthesizer with Phase Synchronization and JESD204B Support; Manufacturer: TEXAS INSTRUMENTS; PressFit: No; Bonding: No; Part Number: LMX2594RHAT; Component Kind: Standard; Component Type: Standard; Device: LMX2594RHAT; PackageDescription: QFN, 0.50mm Pitch, Square; 40 pin, 6.00mm L X 6.00mm W X 1.00mm H body (W/Thermal Tab 4.60mm x 4.60mm), IPC Medium Density; Part Description: 15GHz Wideband PLLatinum RF Synthesizer with Phase Synchronization and JESD204B Support; Manufacturer Part Number: LMX2594RHAT; Pin Count: 41; Case: QFN40; Mounted: Yes; Socket: No; SMD: Yes; Sense: No; ComponentHeight: 1mm; Author: CERN DEM JLC; HelpURL: \\cern.ch\dfs\Applications\Altium\Datasheets\LMX2594RHAT.pdf; CreateDate: 04.12.2018; LatestRevisionDate: 04.12.2018
L27 L28 = IND0402_15NH_2%_COILCRAFT_0402DC: Inductor With Core; Part Description: Ceramic Wirewound Chip Inductor, 0402DC Series; Manufacturer Part Number: 0402DC-15NXGRW; Power: 1A; Resistance: 0.115R; Tolerance: ±2%; Part Number: IND0402_15NH_2%_COILCRAFT_0402DC; Component Kind: Standard; Component Type: Standard; Pin Count: 2; Value: 15nH; Status: None; Manufacturer: COILCRAFT; Case: 0402; Mounted: Yes; Socket: No; SMD: Yes; Sense: No; ComponentHeight: 0.61mm; HelpURL: \\cern.ch\dfs\Applications\Altium\Datasheets\IND0402_COILCRAFT_0402DC.pdf; Author: CERN DEM JLC; CreateDate: 04.12.2018; LatestRevisionDate: 04.12.2018
R162 R163 R170 R175 = R0402_49R9_1%_0.0625W_100PPM: Resistor - 1%; Part Description: General Purpose Thick Film Chip Resistor; Manufacturer: GENERIC; Manufacturer1 Part Number: 232270674999L or RC0402FR-0749R9L; TC: ±100ppm/°C; PressFit: No; Part Number: R0402_49R9_1%_0.0625W_100PPM; Component Kind: Standard; Component Type: Standard; Pin Count: 2; Value: 49R9; Status: Not Recommended; Power: 0.0625W; Tolerance: ±1%; Manufacturer Part Number: R0402_49R9_1%_0.0625W_100PPM; Case: 0402; Mounted: Yes; Sense: No; Socket: No; SMD: Yes; Manufacturer1 Example: YAGEO PHYCOMP; Manufacturer1 ComponentHeight: 0.4mm; HelpURL: \\cern.ch\dfs\Applications\Altium\Datasheets\R0402_Phycomp_RC0402.pdf; Author: CERN DEM JLC; CreateDate: 24.10.2012; LatestRevisionDate: 24.10.2012
R164 = R0402_100R_1%_0.1W_100PPM: Resistor - 1%; Part Description: General Purpose Thick Film Chip Resistor; Manufacturer: GENERIC; Manufacturer Part Number: R0402_100R_1%_0.1W_100PPM_50V; Manufacturer1 Part Number: ERJ2RKF1000X; Power: 0.1W; TC: ±100ppm/°C; Voltage: 50V; PressFit: No; Part Number: R0402_100R_1%_0.1W_100PPM; Component Kind: Standard; Component Type: Standard; Pin Count: 2; Value: 100; Status: Not Recommended; Tolerance: ±1%; Case: 0402; Mounted: Yes; Sense: No; Socket: No; SMD: Yes; Manufacturer1 Example: PANASONIC; Manufacturer1 ComponentHeight: 0.4mm; HelpURL: \\cern.ch\dfs\Applications\Altium\Datasheets\R0402_PANASONIC_ERJ2RK.pdf; Author: CERN DEM JLC; CreateDate: 12.12.2013; LatestRevisionDate: 03.03.2015
R165 R166 = R0402_10K_1%_0.0625W_100PPM: Resistor - 1%; Part Description: General Purpose Thick Film Chip Resistor; Manufacturer: GENERIC; Manufacturer1 Part Number: 232270671003L; TC: ±100ppm/°C; PressFit: No; Part Number: R0402_10K_1%_0.0625W_100PPM; Component Kind: Standard; Component Type: Standard; Pin Count: 2; Value: 10k; Status: Not Recommended; Power: 0.0625W; Tolerance: ±1%; Manufacturer Part Number: R0402_10K_1%_0.0625W_100PPM; Case: 0402; Mounted: Yes; Sense: No; Socket: No; SMD: Yes; Manufacturer1 Example: YAGEO PHYCOMP; Manufacturer1 ComponentHeight: 0.4mm; HelpURL: \\cern.ch\dfs\Applications\Altium\Datasheets\R0402_Phycomp_RC0402.pdf; Author: CERN DEM JLC; CreateDate: 03.12.2007; LatestRevisionDate: 17.10.2012
R167-R169 = R0402_12K_1%_0.0625W_100PPM: Resistor - 1%; Part Description: General Purpose Thick Film Chip Resistor; Manufacturer: GENERIC; Manufacturer1 Part Number: 232270671203L; TC: ±100ppm/°C; PressFit: No; Part Number: R0402_12K_1%_0.0625W_100PPM; Component Kind: Standard; Component Type: Standard; Pin Count: 2; Value: 12k; Status: Not Recommended; Power: 0.0625W; Tolerance: ±1%; Manufacturer Part Number: R0402_12K_1%_0.0625W_100PPM; Case: 0402; Mounted: Yes; Sense: No; Socket: No; SMD: Yes; Manufacturer1 Example: YAGEO PHYCOMP; Manufacturer1 ComponentHeight: 0.4mm; HelpURL: \\cern.ch\dfs\Applications\Altium\Datasheets\R0402_Phycomp_RC0402.pdf; Author: CERN DEM JLC; CreateDate: 03.12.2007; LatestRevisionDate: 17.10.2012
R171 R172 = R0402_0R_JUMPER: Resistor; Part Description: 1A (0.05R Max DC Resistance) Zero Ohm Jumper; Manufacturer: GENERIC; Manufacturer1 Part Number: 232270591001L; PressFit: No; Part Number: R0402_0R_JUMPER; Component Kind: Standard; Component Type: Standard; Pin Count: 2; Value: 0; Status: Not Recommended; Manufacturer Part Number: R0402_0R_JUMPER; Case: 0402; Mounted: Yes; Sense: No; Socket: No; SMD: Yes; Manufacturer1 Example: YAGEO PHYCOMP; Manufacturer1 ComponentHeight: 0.4mm; HelpURL: \\cern.ch\dfs\Applications\Altium\Datasheets\R0402_Phycomp_RC0402.pdf; Author: CERN DEM JLC; CreateDate: 03.12.2007; LatestRevisionDate: 17.10.2012
R173 = R0402_18R_1%_0.0625W_100PPM: Resistor - 1%; Part Description: General Purpose Thick Film Chip Resistor; Manufacturer: GENERIC; Manufacturer1 Part Number: 232270671809L; TC: ±100ppm/°C; PressFit: No; Part Number: R0402_18R_1%_0.0625W_100PPM; Component Kind: Standard; Component Type: Standard; Pin Count: 2; Value: 18; Status: Not Recommended; Power: 0.0625W; Manufacturer Part Number: R0402_18R_1%_0.0625W_100PPM; Case: 0402; Mounted: Yes; Sense: No; Socket: No; SMD: Yes; Manufacturer1 Example: YAGEO PHYCOMP; Manufacturer1 ComponentHeight: 0.4mm; HelpURL: \\cern.ch\dfs\Applications\Altium\Datasheets\R0402_Phycomp_RC0402.pdf; Author: CERN DEM JLC; CreateDate: 03.12.2007; LatestRevisionDate: 17.10.2012
R174 = R0603_68R1_0.1%_0.063W_10PPM: Resistor - 0.1%; Part Description: Thin Film Chip Resistor; Manufacturer: GENERIC; Manufacturer1 Part Number: RN73C1J68R1BTDF; Power: 0.063W; TC: ±10ppm; PressFit: No; Part Number: R0603_68R1_0.1%_0.063W_10PPM; Component Kind: Standard; Component Type: Standard; Pin Count: 2; Value: 68R1; Status: Not Recommended; Tolerance: ±0.1%; Manufacturer Part Number: R0603_68R1_0.1%_0.063W_10PPM; Case: 0603; Mounted: Yes; Sense: No; Socket: No; SMD: Yes; Manufacturer1 Example: TYCO HOLSWORTHY; Manufacturer1 ComponentHeight: 0.5mm; HelpURL: \\cern.ch\dfs\Applications\Altium\Datasheets\R0603_Tyco_RN73.pdf; Author: CERN DEM JLC; CreateDate: 03.12.2007; LatestRevisionDate: 13.03.2008
R176 = R0402_330R_1%_0.0625W_100PPM: Resistor - 1%; Part Description: General Purpose Thick Film Chip Resistor; Manufacturer: GENERIC; Manufacturer1 Part Number: 232270673301L; TC: ±100ppm/°C; PressFit: No; Part Number: R0402_330R_1%_0.0625W_100PPM; Component Kind: Standard; Component Type: Standard; Pin Count: 2; Value: 330; Status: Not Recommended; Power: 0.0625W; Tolerance: ±1%; Manufacturer Part Number: R0402_330R_1%_0.0625W_100PPM; Case: 0402; Mounted: Yes; Sense: No; Socket: No; SMD: Yes; Manufacturer1 Example: YAGEO PHYCOMP; Manufacturer1 ComponentHeight: 0.4mm; HelpURL: \\cern.ch\dfs\Applications\Altium\Datasheets\R0402_Phycomp_RC0402.pdf; Author: CERN DEM JLC; CreateDate: 03.12.2007; LatestRevisionDate: 17.10.2012

## Sheet DAC_PLL.SchDoc: RFSoC AMC
size 420 x 297 mm; CompanyName: WUT; DrawnBy: T. Przywozki; Organization: WUT ISE; Address1: Warsaw University of Technology; Address2: Nowowiejska 15/19 00-665 Warsaw; Address3: Tomasz.Przywozki@pw.edu.pl; DocumentNumber: 20; Revision: 1; SheetNumber: 20; SheetTotal: 45; Project: RFSoC AMC; ModifiedBy: T. Przywozki; CreateDate: -; CheckedDate: -; DivGrp: ISE; Designer: T. Przywozki; ModifiedDate: -; ProjectName: ADC/DAC MEZZANINE
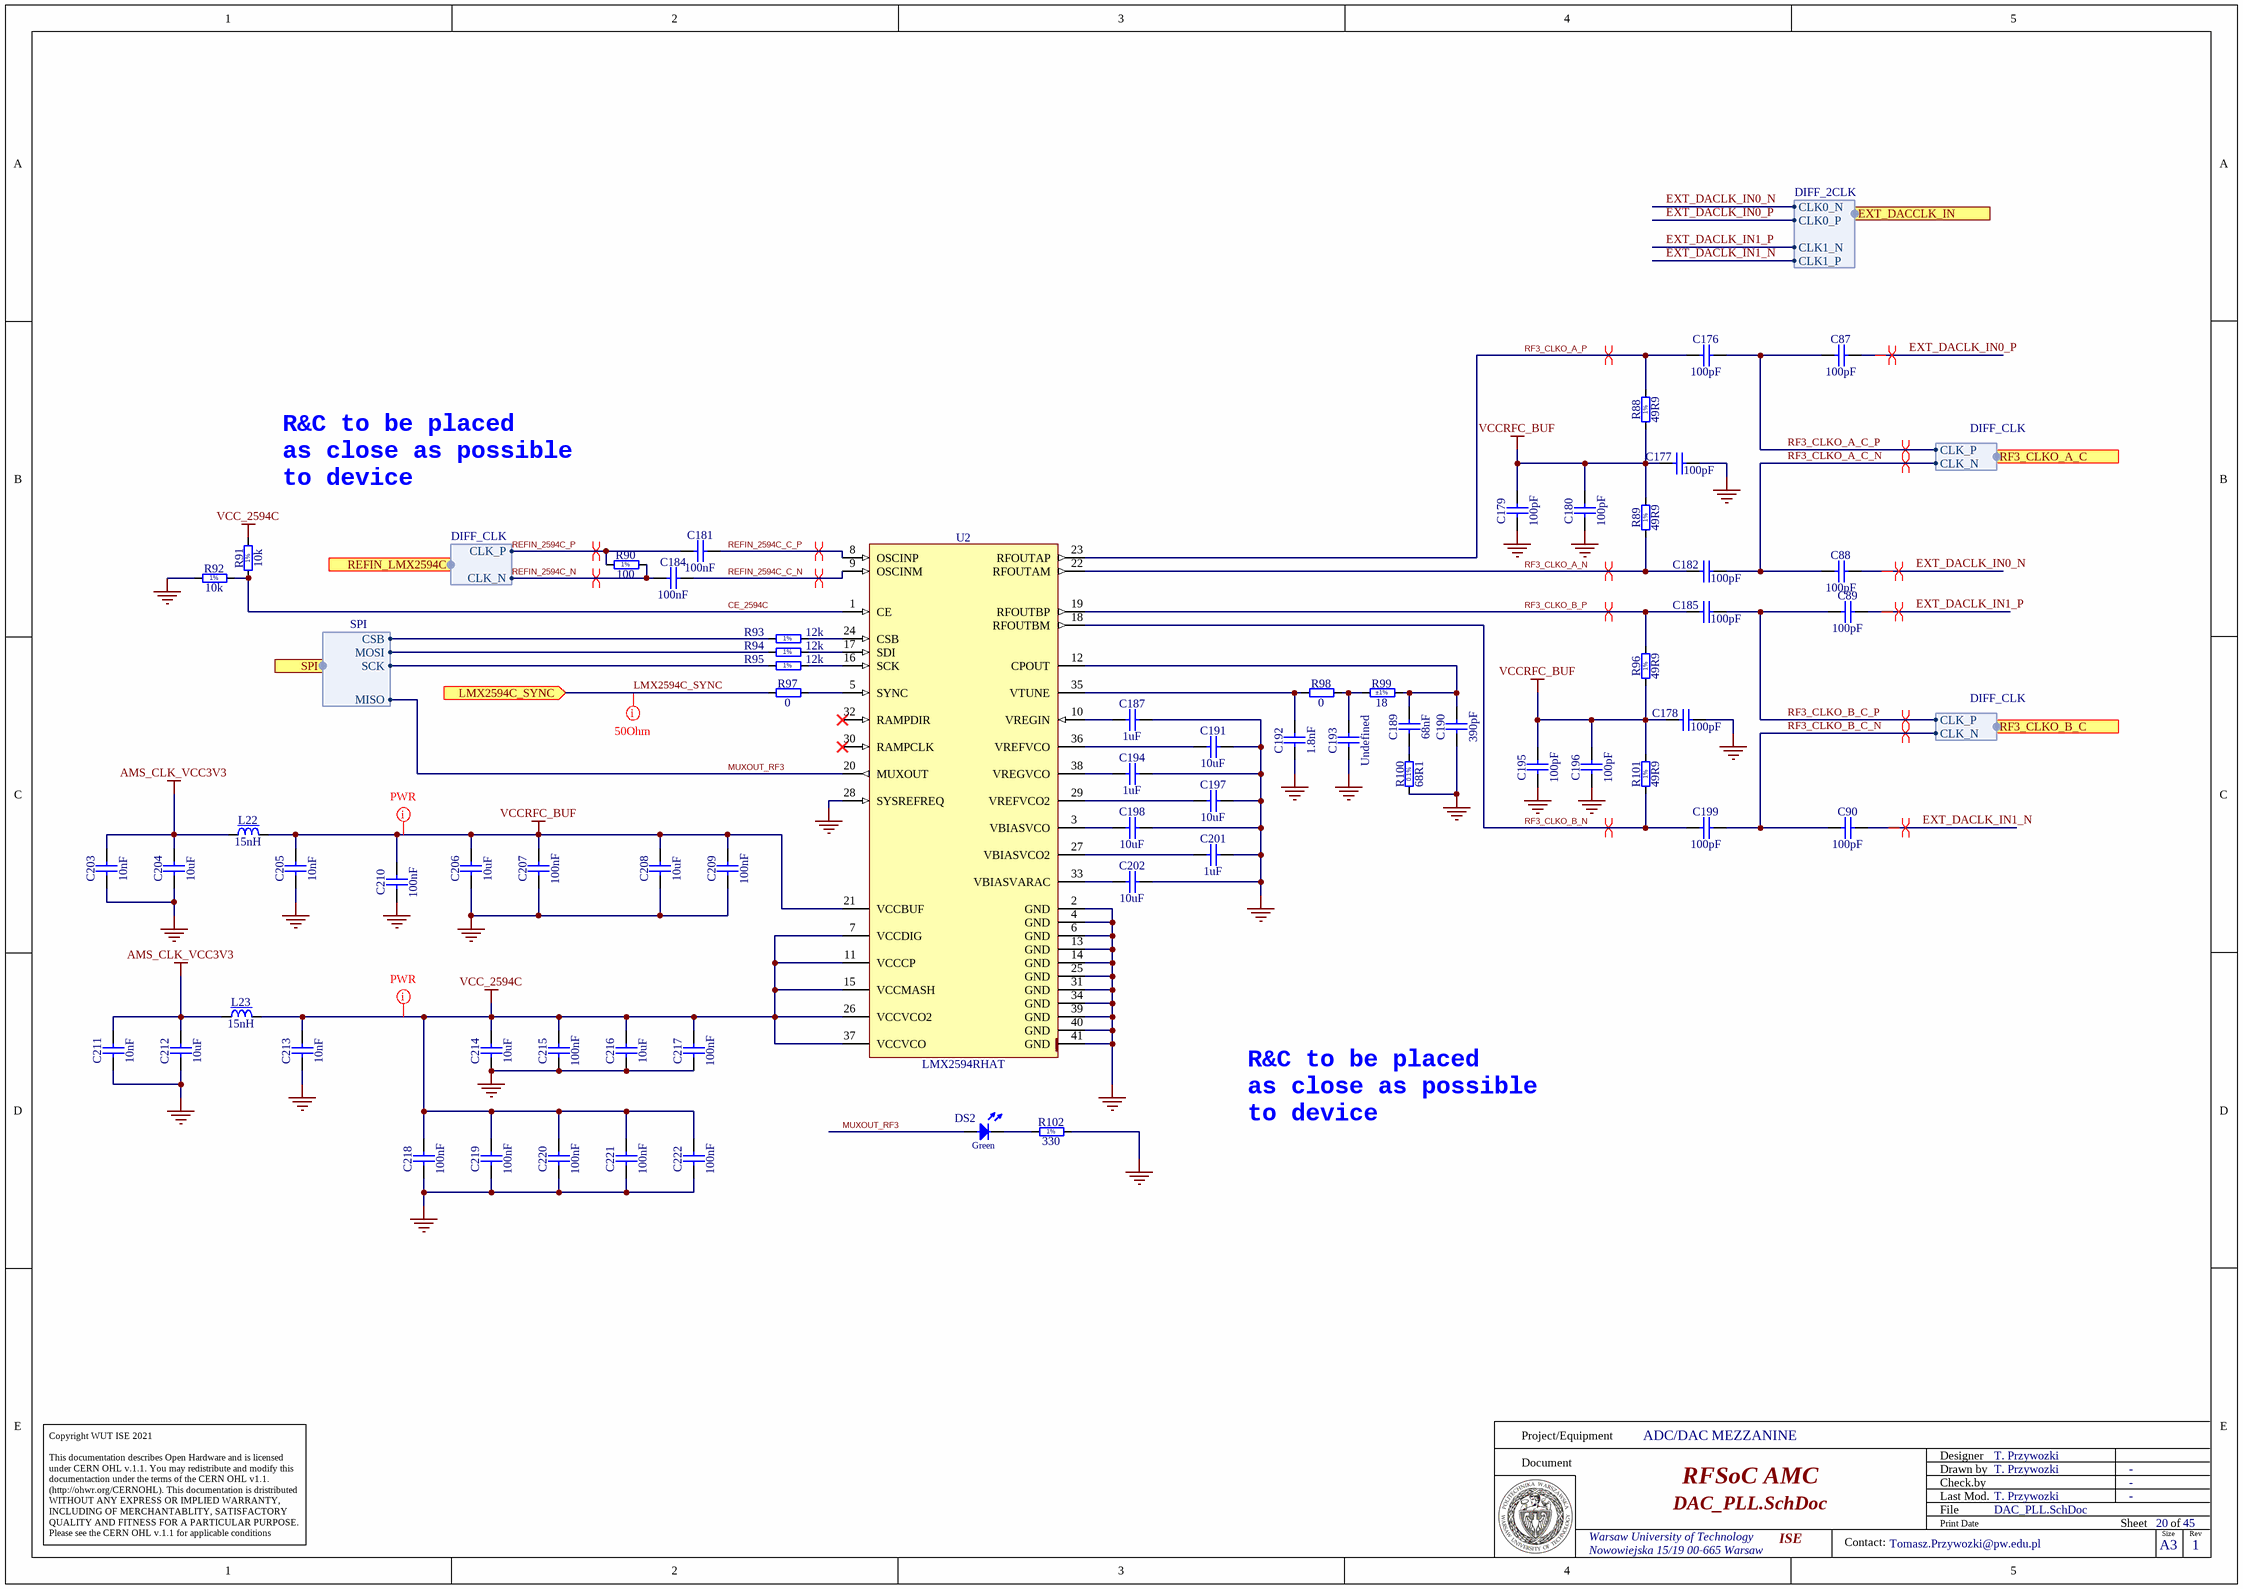
[diagram p6: DAC_PLL.SchDoc]

### Parts
C87  100pF  [CAPC1005X55N]
C88  100pF  [CAPC1005X55N]
C89  100pF  [CAPC1005X55N]
C90  100pF  [CAPC1005X55N]
C176  100pF  [CAPC1005X55N]
C177  100pF  [CAPC1005X55N]
C178  100pF  [CAPC1005X55N]
C179  100pF  [CAPC1005X55N]
C180  100pF  [CAPC1005X55N]
C181  100nF  [CAPC1005X55N]
C182  100pF  [CAPC1005X55N]
C184  100nF  [CAPC1005X55N]
C185  100pF  [CAPC1005X55N]
C187  1uF  [CAPC1005X55N]
C189  68nF  [CAPC1005X55N]
C190  390pF  [CAPC1608X87N]
C191  10uF  [CAPC1608X80N]
C192  1.8nF  [CAPC1608X87N]
C193  Undefined  [CAPC1005X55N]
C194  1uF  [CAPC1005X55N]
C195  100pF  [CAPC1005X55N]
C196  100pF  [CAPC1005X55N]
C197  10uF  [CAPC1608X80N]
C198  10uF  [CAPC1608X80N]
C199  100pF  [CAPC1005X55N]
C201  1uF  [CAPC1005X55N]
C202  10uF  [CAPC1608X80N]
C203  10nF  [CAPC1005X55N]
C204  10uF  [CAPC1608X80N]
C205  10nF  [CAPC1005X55N]
C206  10uF  [CAPC1608X80N]
C207  100nF  [CAPC1005X55N]
C208  10uF  [CAPC1608X80N]
C209  100nF  [CAPC1005X55N]
C210  100nF  [CAPC1005X55N]
C211  10nF  [CAPC1005X55N]
C212  10uF  [CAPC1608X80N]
C213  10nF  [CAPC1005X55N]
C214  10uF  [CAPC1608X80N]
C215  100nF  [CAPC1005X55N]
C216  10uF  [CAPC1608X80N]
C217  100nF  [CAPC1005X55N]
C218  100nF  [CAPC1005X55N]
C219  100nF  [CAPC1005X55N]
C220  100nF  [CAPC1005X55N]
C221  100nF  [CAPC1005X55N]
C222  100nF  [CAPC1005X55N]
DS2  Green  [LED_OSRAM_LGL29K]
L22  15nH  [IND_COILCRAFT_0402DC]
L23  15nH  [IND_COILCRAFT_0402DC]
R88  49R9  [RESC1005X40N]
R89  49R9  [RESC1005X40N]
R90  100  [RESC1005X40N]
R91  10k  [RESC1005X40N]
R92  10k  [RESC1005X40N]
R93  12k  [RESC1005X40N]
R94  12k  [RESC1005X40N]
R95  12k  [RESC1005X40N]
R96  49R9  [RESC1005X40N]
R97  0  [RESC1005X40N]
R98  0  [RESC1005X40N]
R99  18  Tolerance: ±1%  [RESC1005X40N]
R100  68R1  [RESC1608X55N]
R101  49R9  [RESC1005X40N]
R102  330  [RESC1005X40N]
U2  LMX2594RHAT  [QFN50P600X600X100-41N-S460]

### Ports
EXT_DACCLK_IN (harness DIFF_2CLK), LMX2594C_SYNC (in), REFIN_LMX2594C (harness DIFF_CLK), RF3_CLKO_A_C (harness DIFF_CLK), RF3_CLKO_B_C (harness DIFF_CLK), SPI (harness SPI)

### Harnesses
DIFF_CLK: CLK_P, CLK_N
SPI: MOSI, MISO, CSB, SCK
DIFF_2CLK: CLK0_P, CLK0_N, CLK1_P, CLK1_N

### Nets
AMS_CLK_VCC3V3: C203.2 C204.2 C211.2 C212.2 L22.1 L23.1
GND: C177.2 C178.2 C179.1 C180.1 C187.1 C190.1 C191.1 C192.1 C193.1 C194.1 C195.1 C196.1 C197.1 C198.1 C201.1 C202.1 C203.1 C204.1 C205.1 C206.1 C207.1 C208.1 C209.1 C210.1 C211.1 C212.1 C213.1 C214.1 C215.1 C216.1 C217.1 C218.1 C219.1 C220.1 C221.1 C222.1 R92.1 R100.1 R102.2 U2.2(GND) U2.4(GND) U2.6(GND) U2.13(GND) U2.14(GND) U2.25(GND) U2.28(SYSREFREQ) U2.31(GND) U2.34(GND) U2.39(GND) U2.40(GND) U2.41(GND)
VCC_2594C: C213.2 C214.2 C215.2 C216.2 C217.2 C218.2 C219.2 C220.2 C221.2 C222.2 L23.2 R91.2 U2.7(VCCDIG) U2.11(VCCCP) U2.15(VCCMASH) U2.26(VCCVCO2) U2.37(VCCVCO)
VCCRFC_BUF: C177.1 C178.1 C179.2 C180.2 C195.2 C196.2 C205.2 C206.2 C207.2 C208.2 C209.2 C210.2 L22.2 R88.1 R89.2 R96.1 R101.2 U2.21(VCCBUF)
CE_2594C: R91.1 R92.2 U2.1(CE)
CSB_DAC: R93.2 ; port SPI.CSB
EXT_DACLK_IN0_N: C88.2 ; port EXT_DACCLK_IN.CLK0_N  [project net DACLK_IN0_N]
EXT_DACLK_IN0_P: C87.2 ; port EXT_DACCLK_IN.CLK0_P  [project net DACLK_IN0_P]
EXT_DACLK_IN1_N: C90.2 ; port EXT_DACCLK_IN.CLK1_P  [project net DACLK_IN1_P]
EXT_DACLK_IN1_P: C89.2 ; port EXT_DACCLK_IN.CLK1_N  [project net DACLK_IN1_N]
LMX2594C_SYNC: R97.1 ; port LMX2594C_SYNC  [project net LMX2594C]
MOSI: R94.2 ; port SPI.MOSI
MUXOUT_RF3: DS2.2(A) U2.20(MUXOUT) ; port SPI.MISO  [project net MISO_DAC]
REFIN_2594C_C_N: C184.2 U2.9(OSCINM)
REFIN_2594C_C_P: C181.2 U2.8(OSCINP)
REFIN_2594C_N: C184.1 R90.2 ; port REFIN_LMX2594C.CLK_N
REFIN_2594C_P: C181.1 R90.1 ; port REFIN_LMX2594C.CLK_P
RF3_CLKO_A_C_N: C88.1 C182.2 ; port RF3_CLKO_A_C.CLK_N
RF3_CLKO_A_C_P: C87.1 C176.2 ; port RF3_CLKO_A_C.CLK_P
RF3_CLKO_A_N: C182.1 R89.1 U2.22(RFOUTAM)
RF3_CLKO_A_P: C176.1 R88.2 U2.23(RFOUTAP)
RF3_CLKO_B_C_N: C90.1 C199.2 ; port RF3_CLKO_B_C.CLK_N
RF3_CLKO_B_C_P: C89.1 C185.2 ; port RF3_CLKO_B_C.CLK_P
RF3_CLKO_B_N: C199.1 R101.1 U2.18(RFOUTBM)
RF3_CLKO_B_P: C185.1 R96.2 U2.19(RFOUTBP)
SPI_CLK: R95.2 ; port SPI.SCK
NetC187_2: C187.2 U2.10(VREGIN)
NetC189_1: C189.1 R100.2
NetC189_2: C189.2 C190.2 R99.2 U2.12(CPOUT)
NetC191_2: C191.2 U2.36(VREFVCO)
NetC192_2: C192.2 R98.1 U2.35(VTUNE)
NetC193_2: C193.2 R98.2 R99.1
NetC194_2: C194.2 U2.38(VREGVCO)
NetC197_2: C197.2 U2.29(VREFVCO2)
NetC198_2: C198.2 U2.3(VBIASVCO)
NetC201_2: C201.2 U2.27(VBIASVCO2)
NetC202_2: C202.2 U2.33(VBIASVARAC)
NetDS2_1: DS2.1(C) R102.1
NetR93_1: R93.1 U2.24(CSB)
NetR94_1: R94.1 U2.17(SDI)
NetR95_1: R95.1 U2.16(SCK)
NetR97_2: R97.2 U2.5(SYNC)

Not connected (* = marked no-connect by the designer): U2 30(RAMPCLK)* 32(RAMPDIR)*

### Layout directives
differential pair; differential pair class Diff_100Ohm: DACLK_IN0_N, DACLK_IN0_P, DACLK_IN1_N, DACLK_IN1_P, REFIN_2594C_C_N, REFIN_2594C_C_P, REFIN_2594C_N, REFIN_2594C_P, RF3_CLKO_A_C_N, RF3_CLKO_A_C_P, RF3_CLKO_A_N, RF3_CLKO_A_P, RF3_CLKO_B_C_N, RF3_CLKO_B_C_P, RF3_CLKO_B_N, RF3_CLKO_B_P
mark named 50Ohm: LMX2594C
net class PWR: VCC_2594C, VCCRFC_BUF

### Notes on the sheet
- R&C to be placed
  as close as possible
  to device
- Project/Equipment
- Document
- Designer
- Drawn by
- Check.by
- Copyright WUT ISE 2021
  This documentation describes Open Hardware and is licensed under CERN OHL v.1.1. You may redistribute and modify this documentaction under the terms of the CERN OHL v1.1.
  (http://ohwr.org/CERNOHL). This documentation is dristributed WITHOUT ANY EXPRESS OR IMPLIED WARRANTY, INCLUDING OF MERCHANTABLITY, SATISFACTORY QUALITY AND FITNESS FOR A PARTICULAR PURPOSE. Please see the CERN OHL v.1.1 for applicable conditions
- File
- Last Mod.
- Print Date
- Sheet
- Size
- A3
- of
- Rev
- Contact:
- (in symbol R0402_10K_1%_0.0625W_100PPM) 1%
- (in symbol R0402_12K_1%_0.0625W_100PPM) 1%
- (in symbol R0402_49R9_1%_0.0625W_100PPM) 1%
- (in symbol R0402_100R_1%_0.1W_100PPM) 1%
- (in symbol R0402_330R_1%_0.0625W_100PPM) 1%
- (in symbol R0603_68R1_0.1%_0.063W_10PPM) 0.1%

### Library data of the parts
C87-C90 C176-C180 C182 C185 C195 C196 C199 = CC0402_100PF_25V_5%_C0G_KEMET_HiQ-CBR: as C91 on sheet ADC_PLL; Part Number: CC0402_100PF_25V_5%_C0G_KEMET_HiQ-CBR; Component Kind: Standard; Component Type: Standard; Pin Count: 2; Value: 100pF; Status: Not Recommended; Case: 0402; Mounted: Yes; Socket: No; SMD: Yes; Sense: No; ComponentHeight: 0.55mm; HelpURL: \\cern.ch\dfs\Applications\Altium\Datasheets\CC0402_C0G_KEMET_HiQ-CBR.pdf; Author: CERN DEM MR; CreateDate: 17.11.2017; LatestRevisionDate: 21.11.2017
C181 C184 C207 C209 C210 C215 C217-C222 = CC0402_100NF_25V_10%_X7R_YUDEN_TMK105B7104KVHF: as C319 on sheet ADC_PLL; Part Number: CC0402_100NF_25V_10%_X7R_YUDEN_TMK105B7104KVHF; Component Kind: Standard; Component Type: Standard; Pin Count: 2; Value: 100nF; Status: Not Recommended; Manufacturer Part Number: TMK105B7104KVHF; Case: 0402; Mounted: Yes; Socket: No; SMD: Yes; Sense: No; ComponentHeight: 0.55mm; HelpURL: \\cern.ch\dfs\Applications\Altium\Datasheets\CC0402_TAIYO-YUDEN_TMK105B7104KVHF.pdf; Author: CERN DEM JLC; CreateDate: 10.05.2017; LatestRevisionDate: 10.05.2017
C187 C194 C201 = CC0402_1UF_16V_10%_X5R: as C932 on sheet RFMC_DAC; Part Number: CC0402_1UF_16V_10%_X5R; Component Kind: Standard; Component Type: Standard; Pin Count: 2; Value: 1uF; Status: Preferred; Manufacturer Part Number: CC0402_1UF_16V_10%_X5R; Case: 0402; Mounted: Yes; Socket: No; SMD: Yes; Sense: No; Manufacturer1 Example: TDK; Manufacturer1 ComponentHeight: 0.55mm; HelpURL: \\cern.ch\dfs\Applications\Altium\Datasheets\CC0402_X5R_TDK_C.pdf; Author: CERN DEM JLC; CreateDate: 25.10.2012; LatestRevisionDate: 25.10.2012
C189 = CC0402_68NF_16V_10%_X7R: as C327 on sheet ADC_PLL; Part Number: CC0402_68NF_16V_10%_X7R; Component Kind: Standard; Component Type: Standard; Pin Count: 2; Value: 68nF; Status: Not Recommended; Manufacturer Part Number: CC0402_68NF_16V_10%_X7R; Case: 0402; Mounted: Yes; Socket: No; SMD: Yes; Sense: No; Manufacturer1 Example: PHYCOMP; Manufacturer1 ComponentHeight: 0.55mm; HelpURL: \\cern.ch\dfs\Applications\Altium\Datasheets\CC0402_X7R_PHYCOMP.pdf; Author: CERN DEM JLC; CreateDate: 03.12.2007; LatestRevisionDate: 03.12.2007
C190 = CC0603_390PF_50V_5%_NP0: as C328 on sheet ADC_PLL; Part Number: CC0603_390PF_50V_5%_NP0; Component Kind: Standard; Component Type: Standard; Pin Count: 2; Value: 390pF; Status: Preferred; Manufacturer Part Number: CC0603_390PF_50V_5%_NP0; Case: 0603; Mounted: Yes; Socket: No; SMD: Yes; Sense: No; Manufacturer1 Example: PHYCOMP; Manufacturer1 ComponentHeight: 0.87mm; HelpURL: \\cern.ch\dfs\Applications\Altium\Datasheets\CC0603_NP0_PHYCOMP.pdf; Author: CERN DEM JLC; CreateDate: 03.12.2007; LatestRevisionDate: 03.12.2007
C191 C197 C198 C202 C204 C206 C208 C212 C214 C216 = CC0603_10UF_10V_10%_X5R: as C776 on sheet RFMC_DAC; Part Number: CC0603_10UF_10V_10%_X5R; Component Kind: Standard; Component Type: Standard; Pin Count: 2; Value: 10uF; Status: None; Manufacturer Part Number: CC0603_10UF_10V_10%_X5R; Case: 0603; Mounted: Yes; Socket: No; SMD: Yes; Sense: No; Manufacturer1 Example: MURATA; Manufacturer1 ComponentHeight: 0.8mm; HelpURL: \\cern.ch\dfs\Applications\Altium\Datasheets\CC0603_MURATA_GRM188R61A106KE69D.pdf; Author: CERN DEM JLC; CreateDate: 31.01.2017; LatestRevisionDate: 31.01.2017
C192 = CC0603_1.8NF_50V_5%_X7R: as C330 on sheet ADC_PLL; Part Number: CC0603_1.8NF_50V_5%_X7R; Component Kind: Standard; Component Type: Standard; Pin Count: 2; Value: 1.8nF; Status: Preferred; Manufacturer Part Number: CC0603_1.8NF_50V_5%_X7R; Case: 0603; Mounted: Yes; Socket: No; SMD: Yes; Sense: No; Manufacturer1 Example: KEMET; Manufacturer1 ComponentHeight: 0.87mm; HelpURL: \\cern.ch\dfs\Applications\Altium\Datasheets\CC0603_X7R_KEMET.pdf; Author: CERN DEM JLC; CreateDate: 31.05.2018; LatestRevisionDate: 31.05.2018
C193 = CC0402_NO-VALUE: as C331 on sheet ADC_PLL; Part Number: CC0402_NO-VALUE; Component Kind: Standard; Component Type: Standard; Pin Count: 2; Value: Undefined; Status: None; Manufacturer: Undefined; Manufacturer Part Number: CC0402_NO-VALUE; Case: 0402; Socket: No; SMD: Yes; Sense: No; Manufacturer1 ComponentHeight: 0.55mm; HelpURL: Undefined; Author: CERN DEM JLC; CreateDate: 14.01.2014; LatestRevisionDate: 14.01.2014
C203 C205 C211 C213 = CC0402_10NF_16V_10%_X7R: as C341 on sheet ADC_PLL; Part Number: CC0402_10NF_16V_10%_X7R; Component Kind: Standard; Component Type: Standard; Pin Count: 2; Value: 10nF; Status: Not Recommended; Manufacturer Part Number: CC0402_10NF_16V_10%_X7R; Case: 0402; Mounted: Yes; Socket: No; SMD: Yes; Sense: No; Manufacturer1 Example: PHYCOMP; Manufacturer1 ComponentHeight: 0.55mm; HelpURL: \\cern.ch\dfs\Applications\Altium\Datasheets\CC0402_X7R_PHYCOMP.pdf; Author: CERN DEM JLC; CreateDate: 03.12.2007; LatestRevisionDate: 03.12.2007
DS2 = LED_OSRAM_LG L29K-G2J1-24-Z: as DS3 on sheet ADC_PLL; Part Number: LED_OSRAM_LG L29K-G2J1-24-Z; Component Kind: Standard; Component Type: Standard; Color: Green; PackageDescription: Green Chip LED, 2-Leads, Body 1.7x0.8mm, IPC Medium Density; Status: Not Recommended; Manufacturer Part Number: LG L29K-G2J1-24-Z; Pin Count: 2; Case: 0603; Mounted: Yes; Socket: No; SMD: Yes; Sense: No; ComponentHeight: 0.67mm; HelpURL: \\cern.ch\dfs\Applications\Altium\Datasheets\LED_OSRAM_LGL29K.pdf; Author: CERN DEM JLC; CreateDate: 24.04.2012; LatestRevisionDate: 24.04.2012
L22 L23 = IND0402_15NH_2%_COILCRAFT_0402DC: as L27 on sheet ADC_PLL; Part Number: IND0402_15NH_2%_COILCRAFT_0402DC; Component Kind: Standard; Component Type: Standard; Pin Count: 2; Value: 15nH; Status: None; Manufacturer: COILCRAFT; Case: 0402; Mounted: Yes; Socket: No; SMD: Yes; Sense: No; ComponentHeight: 0.61mm; HelpURL: \\cern.ch\dfs\Applications\Altium\Datasheets\IND0402_COILCRAFT_0402DC.pdf; Author: CERN DEM JLC; CreateDate: 04.12.2018; LatestRevisionDate: 04.12.2018
R88 R89 R96 R101 = R0402_49R9_1%_0.0625W_100PPM: as R162 on sheet ADC_PLL; Part Number: R0402_49R9_1%_0.0625W_100PPM; Component Kind: Standard; Component Type: Standard; Pin Count: 2; Value: 49R9; Status: Not Recommended; Power: 0.0625W; Tolerance: ±1%; Manufacturer Part Number: R0402_49R9_1%_0.0625W_100PPM; Case: 0402; Mounted: Yes; Sense: No; Socket: No; SMD: Yes; Manufacturer1 Example: YAGEO PHYCOMP; Manufacturer1 ComponentHeight: 0.4mm; HelpURL: \\cern.ch\dfs\Applications\Altium\Datasheets\R0402_Phycomp_RC0402.pdf; Author: CERN DEM JLC; CreateDate: 24.10.2012; LatestRevisionDate: 24.10.2012
R90 = R0402_100R_1%_0.1W_100PPM: as R164 on sheet ADC_PLL; Part Number: R0402_100R_1%_0.1W_100PPM; Component Kind: Standard; Component Type: Standard; Pin Count: 2; Value: 100; Status: Not Recommended; Tolerance: ±1%; Case: 0402; Mounted: Yes; Sense: No; Socket: No; SMD: Yes; Manufacturer1 Example: PANASONIC; Manufacturer1 ComponentHeight: 0.4mm; HelpURL: \\cern.ch\dfs\Applications\Altium\Datasheets\R0402_PANASONIC_ERJ2RK.pdf; Author: CERN DEM JLC; CreateDate: 12.12.2013; LatestRevisionDate: 03.03.2015
R91 R92 = R0402_10K_1%_0.0625W_100PPM: as R165 on sheet ADC_PLL; Part Number: R0402_10K_1%_0.0625W_100PPM; Component Kind: Standard; Component Type: Standard; Pin Count: 2; Value: 10k; Status: Not Recommended; Power: 0.0625W; Tolerance: ±1%; Manufacturer Part Number: R0402_10K_1%_0.0625W_100PPM; Case: 0402; Mounted: Yes; Sense: No; Socket: No; SMD: Yes; Manufacturer1 Example: YAGEO PHYCOMP; Manufacturer1 ComponentHeight: 0.4mm; HelpURL: \\cern.ch\dfs\Applications\Altium\Datasheets\R0402_Phycomp_RC0402.pdf; Author: CERN DEM JLC; CreateDate: 03.12.2007; LatestRevisionDate: 17.10.2012
R93-R95 = R0402_12K_1%_0.0625W_100PPM: as R167 on sheet ADC_PLL; Part Number: R0402_12K_1%_0.0625W_100PPM; Component Kind: Standard; Component Type: Standard; Pin Count: 2; Value: 12k; Status: Not Recommended; Power: 0.0625W; Tolerance: ±1%; Manufacturer Part Number: R0402_12K_1%_0.0625W_100PPM; Case: 0402; Mounted: Yes; Sense: No; Socket: No; SMD: Yes; Manufacturer1 Example: YAGEO PHYCOMP; Manufacturer1 ComponentHeight: 0.4mm; HelpURL: \\cern.ch\dfs\Applications\Altium\Datasheets\R0402_Phycomp_RC0402.pdf; Author: CERN DEM JLC; CreateDate: 03.12.2007; LatestRevisionDate: 17.10.2012
R97 R98 = R0402_0R_JUMPER: as R171 on sheet ADC_PLL; Part Number: R0402_0R_JUMPER; Component Kind: Standard; Component Type: Standard; Pin Count: 2; Value: 0; Status: Not Recommended; Manufacturer Part Number: R0402_0R_JUMPER; Case: 0402; Mounted: Yes; Sense: No; Socket: No; SMD: Yes; Manufacturer1 Example: YAGEO PHYCOMP; Manufacturer1 ComponentHeight: 0.4mm; HelpURL: \\cern.ch\dfs\Applications\Altium\Datasheets\R0402_Phycomp_RC0402.pdf; Author: CERN DEM JLC; CreateDate: 03.12.2007; LatestRevisionDate: 17.10.2012
R99 = R0402_18R_1%_0.0625W_100PPM: as R173 on sheet ADC_PLL; Part Number: R0402_18R_1%_0.0625W_100PPM; Component Kind: Standard; Component Type: Standard; Pin Count: 2; Value: 18; Status: Not Recommended; Power: 0.0625W; Manufacturer Part Number: R0402_18R_1%_0.0625W_100PPM; Case: 0402; Mounted: Yes; Sense: No; Socket: No; SMD: Yes; Manufacturer1 Example: YAGEO PHYCOMP; Manufacturer1 ComponentHeight: 0.4mm; HelpURL: \\cern.ch\dfs\Applications\Altium\Datasheets\R0402_Phycomp_RC0402.pdf; Author: CERN DEM JLC; CreateDate: 03.12.2007; LatestRevisionDate: 17.10.2012
R100 = R0603_68R1_0.1%_0.063W_10PPM: as R174 on sheet ADC_PLL; Part Number: R0603_68R1_0.1%_0.063W_10PPM; Component Kind: Standard; Component Type: Standard; Pin Count: 2; Value: 68R1; Status: Not Recommended; Tolerance: ±0.1%; Manufacturer Part Number: R0603_68R1_0.1%_0.063W_10PPM; Case: 0603; Mounted: Yes; Sense: No; Socket: No; SMD: Yes; Manufacturer1 Example: TYCO HOLSWORTHY; Manufacturer1 ComponentHeight: 0.5mm; HelpURL: \\cern.ch\dfs\Applications\Altium\Datasheets\R0603_Tyco_RN73.pdf; Author: CERN DEM JLC; CreateDate: 03.12.2007; LatestRevisionDate: 13.03.2008
R102 = R0402_330R_1%_0.0625W_100PPM: as R176 on sheet ADC_PLL; Tolerance: ±1%; Power: 0.0625W; Part Number: R0402_330R_1%_0.0625W_100PPM; Component Kind: Standard; Component Type: Standard; Pin Count: 2; Value: 330; Status: Not Recommended; Manufacturer Part Number: R0402_330R_1%_0.0625W_100PPM; Case: 0402; Mounted: Yes; Sense: No; Socket: No; SMD: Yes; Manufacturer1 Example: YAGEO PHYCOMP; Manufacturer1 ComponentHeight: 0.4mm; HelpURL: \\cern.ch\dfs\Applications\Altium\Datasheets\R0402_Phycomp_RC0402.pdf; Author: CERN DEM JLC; CreateDate: 03.12.2007; LatestRevisionDate: 17.10.2012
U2 = LMX2594RHAT: as IC21 on sheet ADC_PLL; Part Number: LMX2594RHAT; Component Kind: Standard; Component Type: Standard; Device: LMX2594RHAT; PackageDescription: QFN, 0.50mm Pitch, Square; 40 pin, 6.00mm L X 6.00mm W X 1.00mm H body (W/Thermal Tab 4.60mm x 4.60mm), IPC Medium Density; Part Description: 15GHz Wideband PLLatinum RF Synthesizer with Phase Synchronization and JESD204B Support; Manufacturer Part Number: LMX2594RHAT; Pin Count: 41; Case: QFN40; Mounted: Yes; Socket: No; SMD: Yes; Sense: No; ComponentHeight: 1mm; Author: CERN DEM JLC; HelpURL: \\cern.ch\dfs\Applications\Altium\Datasheets\LMX2594RHAT.pdf; CreateDate: 04.12.2018; LatestRevisionDate: 04.12.2018